# EAGLE board main (EAGLE 7.7.0)
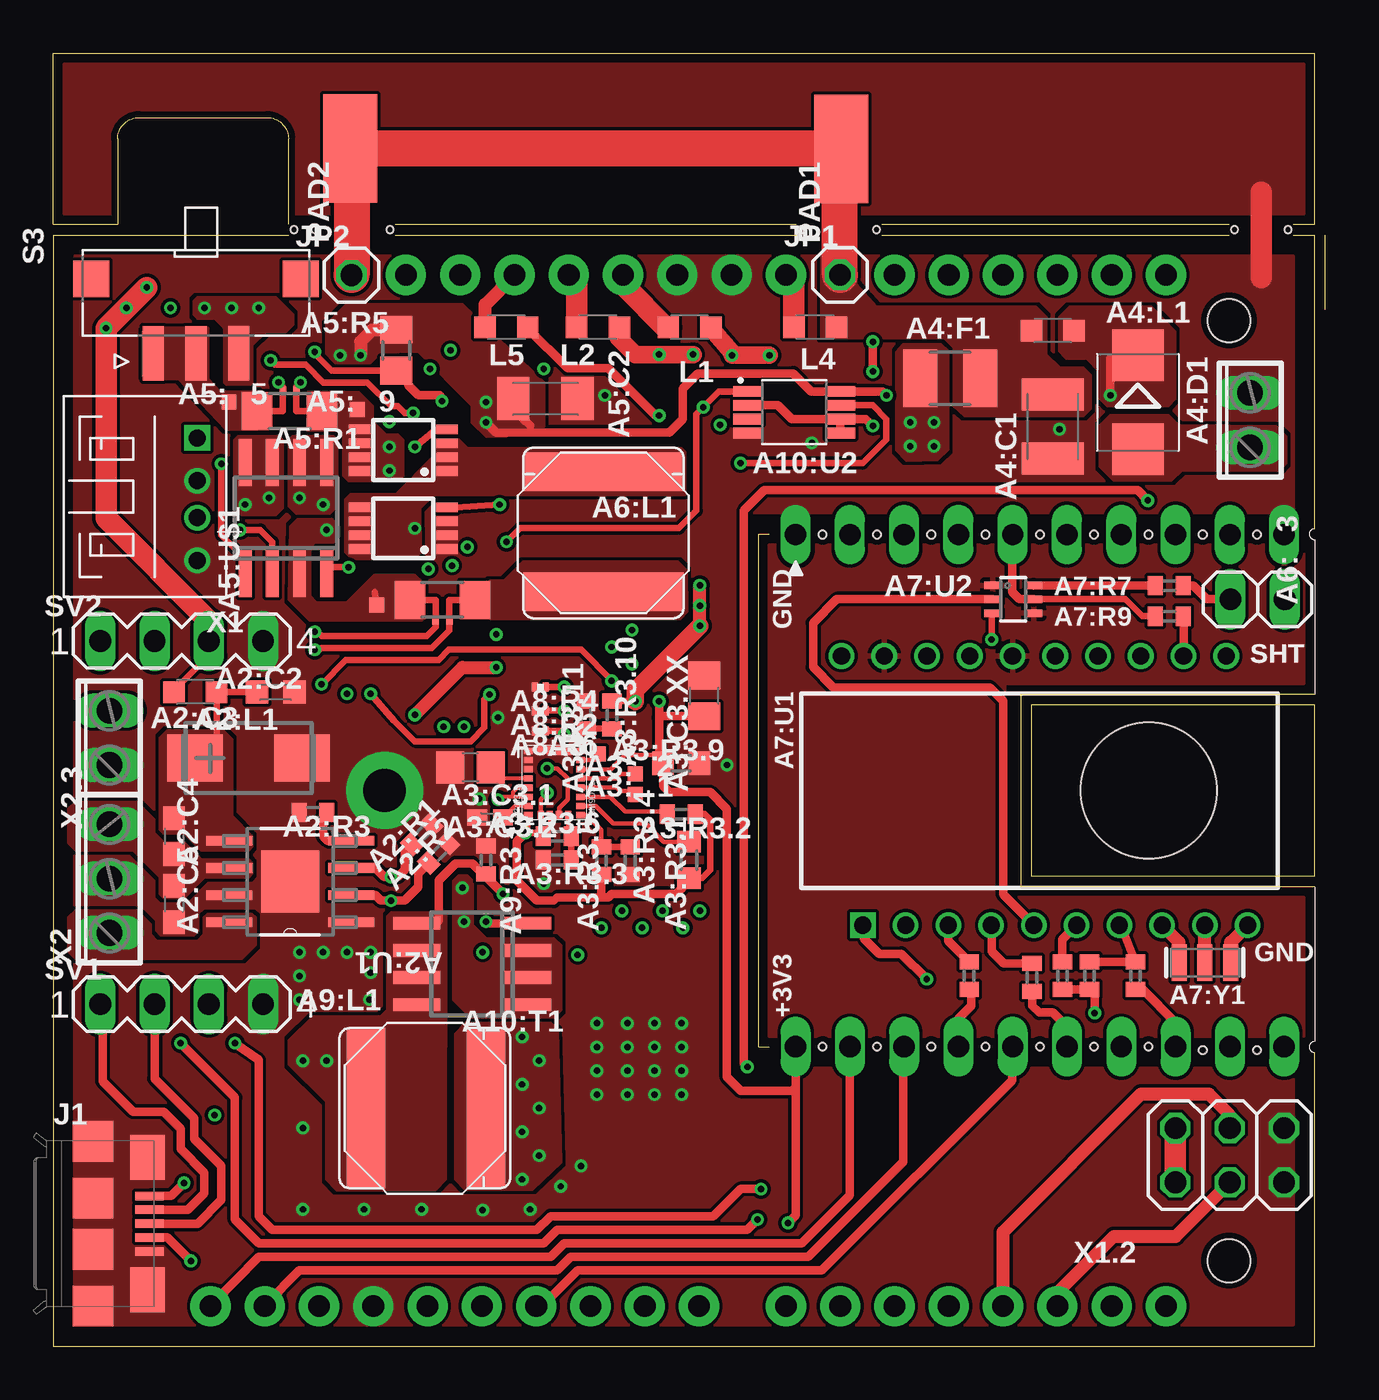
[diagram p13: board, top side]
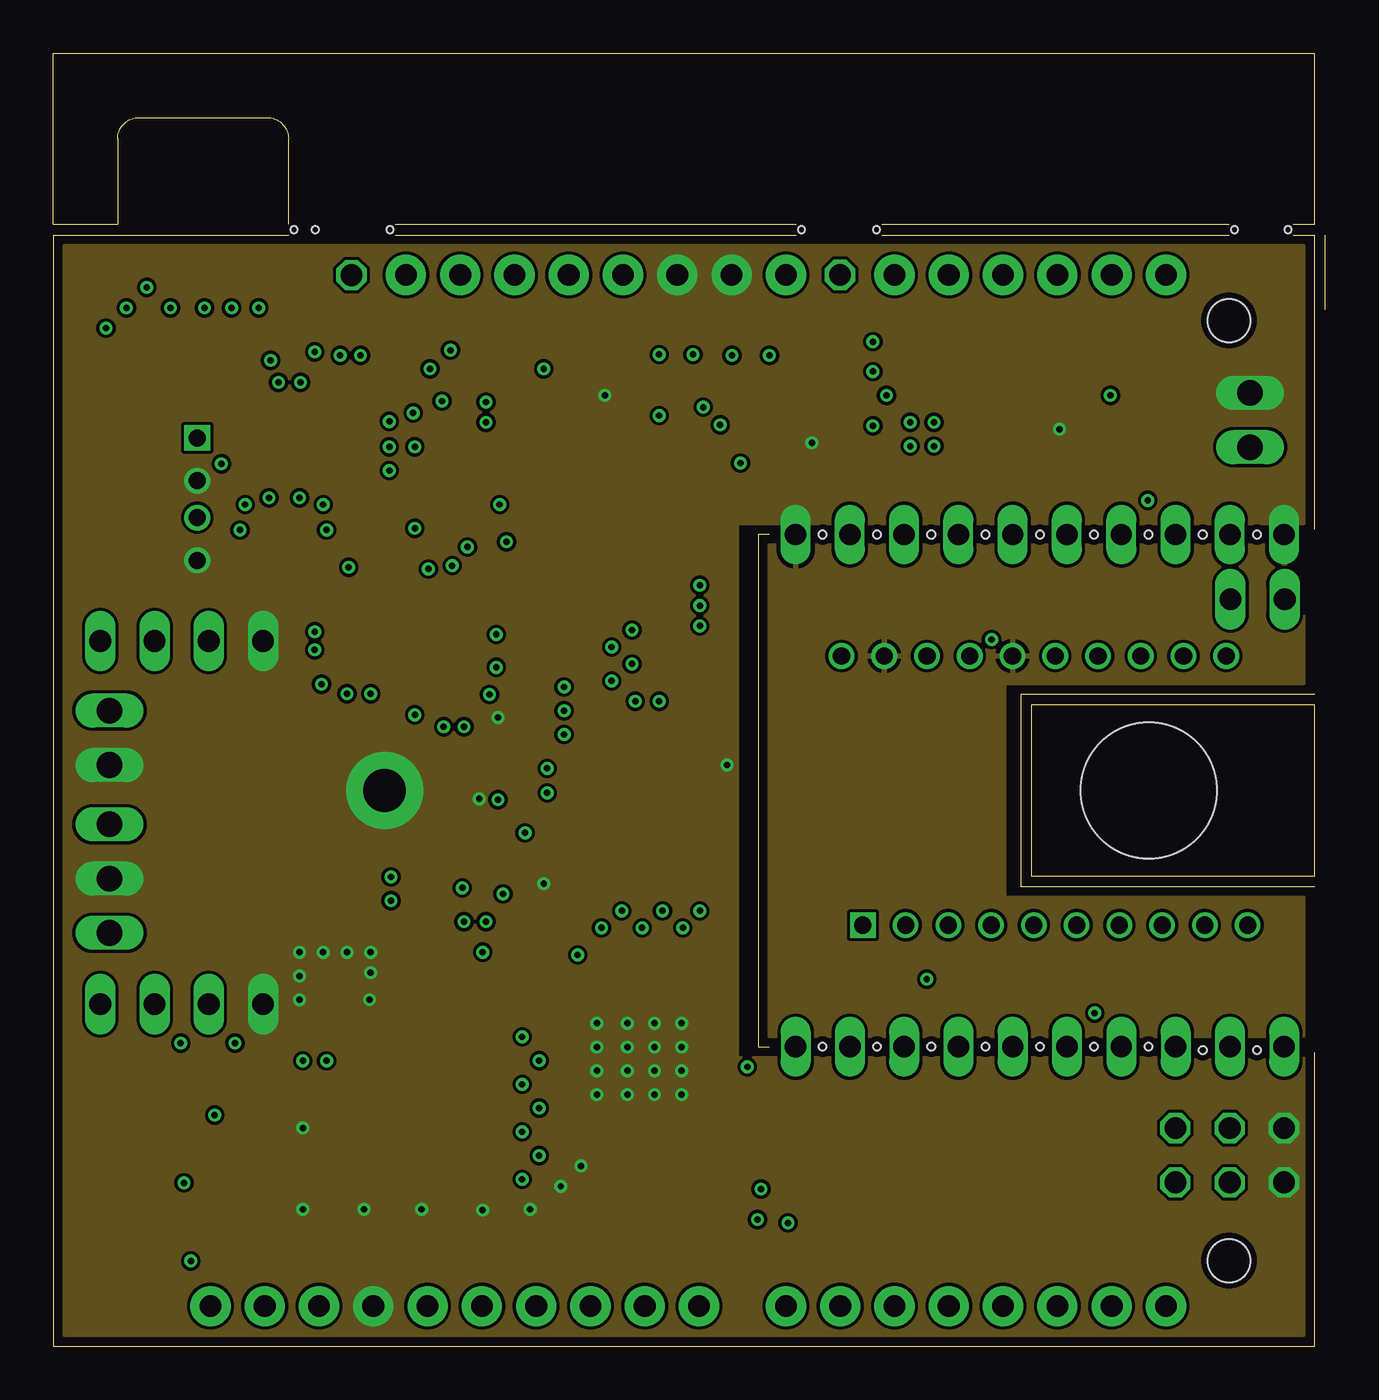
[diagram p14: board, inner layer Route2]
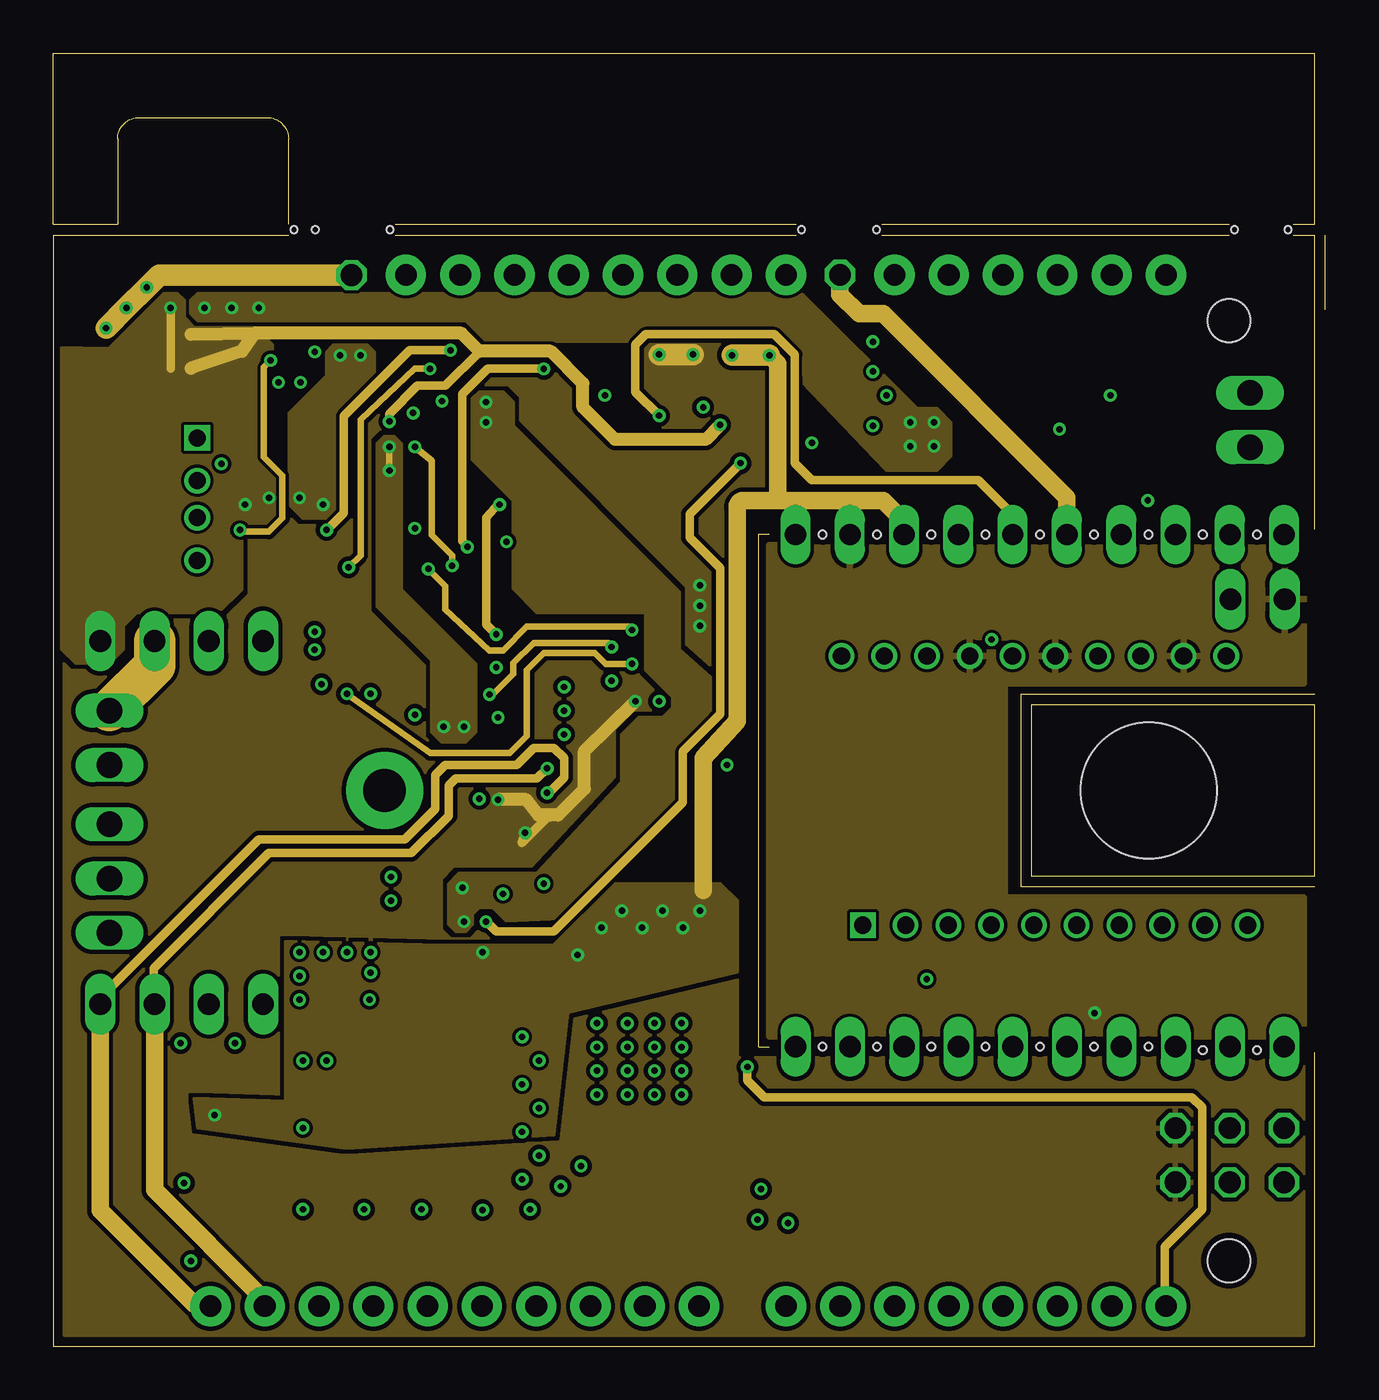
[diagram p15: board, inner layer Route15]
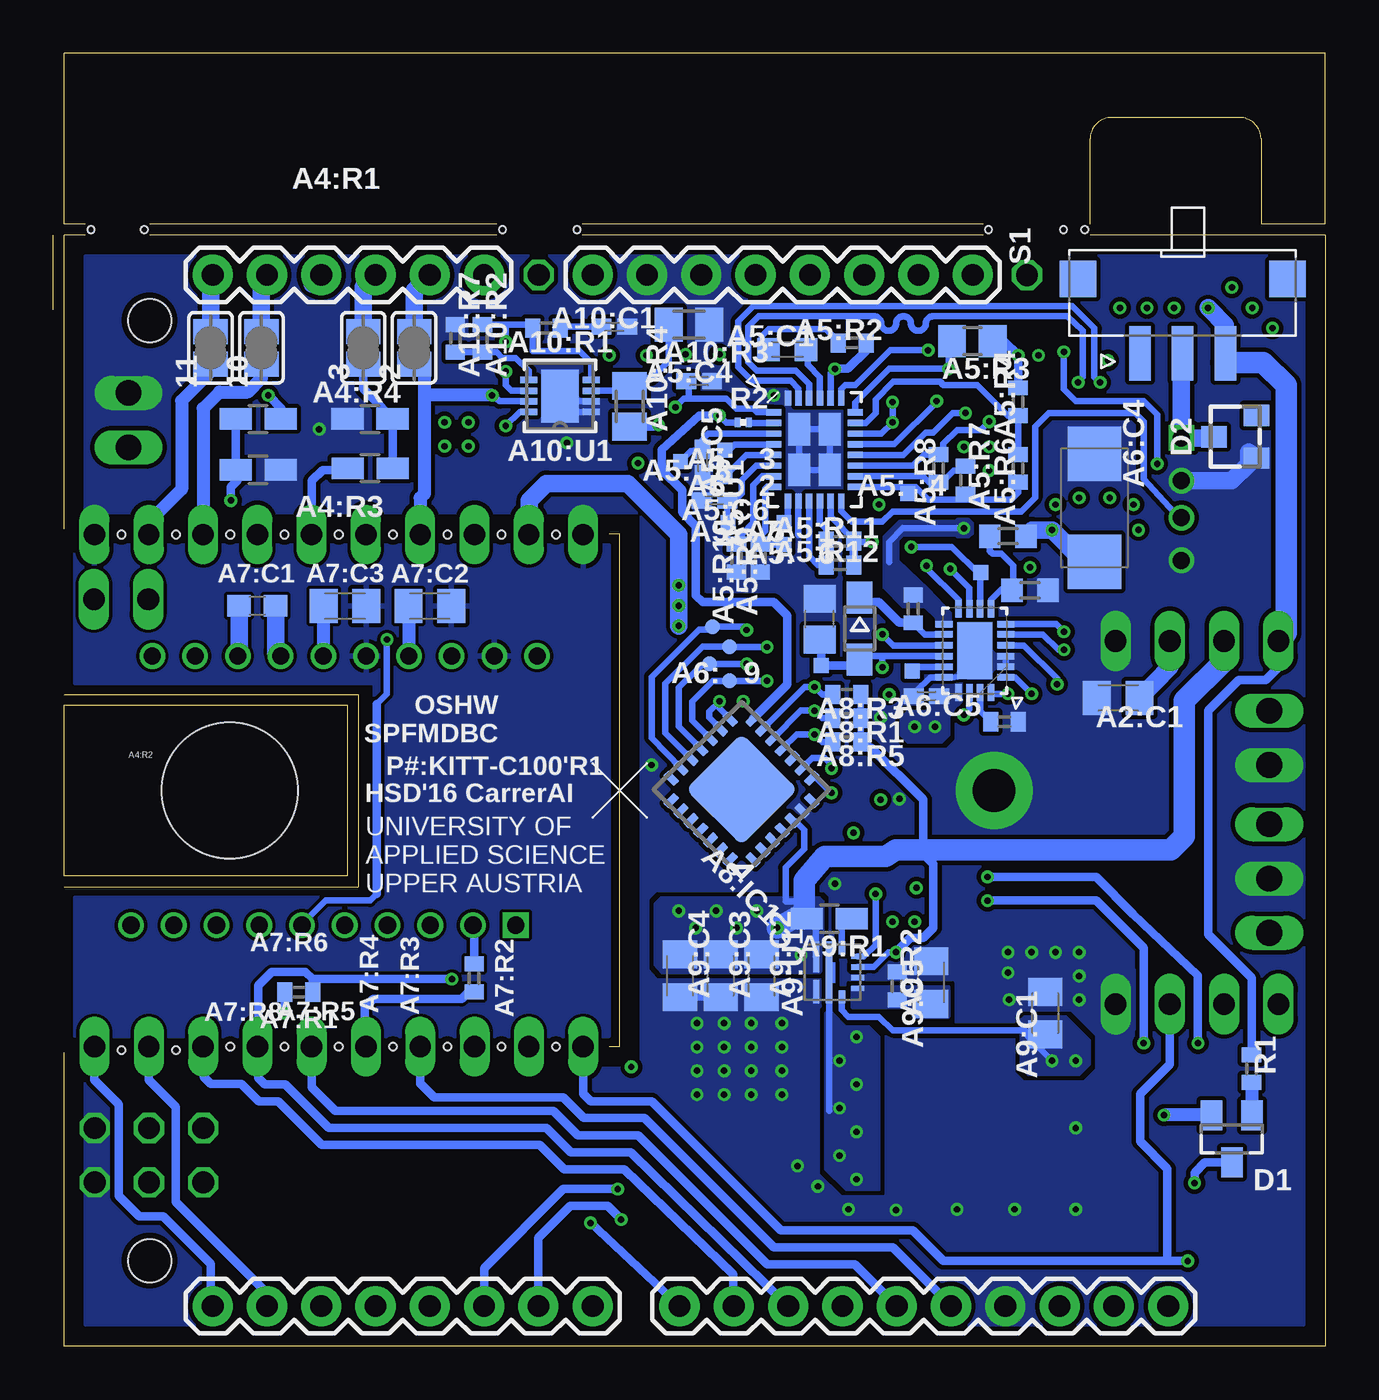
[diagram p16: board, bottom side, seen from below]

Size 59.5 x 60.5 mm. Coordinates in mm from the lower left corner, seen from the top.
Outline: 11,52 0,52 0,0 59,0 59,13.75
Outline: 16,52 34.75,52
Outline: 38.75,52 55,52
Outline: 58,52 59,52 59,38.25
Outline: 59,30.5 45.25,30.5 45.25,21.5 59,21.5
Outline: 33.5,14 33,14 33,38 33.5,38
Outline: 59.5,48.5 59.5,52
Outline: 16,52.5 34.75,52.5
Outline: 38.75,52.5 55,52.5
Outline: 58,52.5 59,52.5 59,60.5 0,60.5 0,52.5 3,52.5 3,56.5 arc-90 4,57.5 10,57.5 arc-90 11,56.5 11,52.5
Outline: 59,30 45.75,30 45.75,22 59,22 59,30
Copper layers (1+2*15+16): Top 0.035mm / dielectric 0.38mm / Route2 0.035mm / dielectric 0.71mm / Route15 0.035mm / dielectric 0.38mm / Bottom 0.035mm
Design rules "PCB-POOL Standard_ML4": minimum track width 0.15mm, minimum drill 0.3mm, track to track 0.15mm, track to pad 0.15mm, pad to pad 0.15mm, via to via 0.15mm, smd to smd 0.15mm, copper to edge 0.3mm, drill to drill 0.2mm, minimum pad ring 0.2mm, minimum via ring 0.15mm, stop-mask expansion 0.075mm, vias tented up to drill 0mil, thermal gap 0.2mm
Holes 0.35 mm at 35.99,37.98 38.53,37.98 41.07,37.98 43.61,37.98 46.15,37.98 48.69,37.98 51.23,37.98 53.77,37.98 56.31,37.98 56.31,13.85 53.77,13.85 51.23,14.01 48.69,14.01 46.15,14.01 43.61,14.01 41.07,14.01 38.53,14.01 35.99,14.01
Holes 2 mm at 55,4 55,48
Holes 0.3 mm at 12.25,52.25 15.75,52.25 35,52.25 38.5,52.25 55.25,52.25 57.75,52.25 11.25,52.25
Milling: area -49,-60 to -41,-58

## Footprints (pad centres in the part's own frame; a part is rotated, then mirrored left to right if it is on the bottom)
C0805K = smd 1.3 x 1.6: 1 -1,0; 2 1,0
C0603K = smd 1.05 x 1.08: 1 -0.875,0; 2 0.875,0
CT6032 = smd 2.6 x 2.2: + -2.5,0; - 2.5,0
C0603 = smd 1.1 x 1: 1 -0.85,0; 2 0.85,0
L2012C = smd 1 x 1: 1 -1,0; 2 1,0
R0402 = smd 0.7 x 0.9: 1 -0.65,0; 2 0.65,0
HSOP8 = smd 2.15 x 0.45: 1 -2.857,1.905; 2 -2.857,0.635; 3 -2.857,-0.635; 4 -2.857,-1.905; 5 2.857,-1.905; 6 2.857,-0.635; 7 2.857,0.635; 8 2.857,1.905 | smd 2.7 x 2.9: THERMAL 0,0
C0805 = smd 1.3 x 1.5: 1 -0.95,0; 2 0.95,0
C0402K = smd 0.925 x 0.74: 1 -0.6,0; 2 0.6,0
R0603 = smd 1 x 1.1: 1 -0.85,0; 2 0.85,0
LGA-24 = smd 0.29 x 0.4: 1 -0.025,2.45; 6 -0.025,0; 7 0.405,0; 8 0.835,0; 9 1.264,0; 10 1.694,0; 11 2.124,0; 12 2.554,0; 13 2.985,0; 18 2.985,2.45; 19 2.554,2.45; 20 2.124,2.45; 21 1.694,2.45; 22 1.264,2.45; 23 0.835,2.45; 24 0.405,2.45 | smd 0.4 x 0.29: 2 -0.025,1.87; 3 -0.025,1.44; 4 -0.025,1.01; 5 -0.025,0.58; 14 2.985,0.58; 15 2.985,1.01; 16 2.985,1.44; 17 2.985,1.87
TP07SQ = smd 0.7 x 0.7: TP 0,0
C1210K = smd 1.5 x 2.9: 1 -1.5,0; 2 1.5,0
SMB = smd 2.4 x 2.4: A 2.2,0; C -2.2,0
R1210 = smd 1.6 x 2.7: 1 -1.4,0; 2 1.4,0
R0805W = smd 1.5 x 1: 1 -1.052,0; 2 1.052,0
C1206K = smd 1.5 x 2: 1 -1.5,0; 2 1.5,0
R1206-KELV = smd 1.422 x 1.778: + -1.524,0; - 1.524,0 | smd 0.305 x 0.406: K+ -0.318,-0.953; K- 0.318,-0.953
R0805 = smd 1.3 x 1.5: 1 -0.95,0; 2 0.95,0
QFN-28_UFD-L = smd 0.703 x 0.3: 1 -1.902,1.75; 2 -1.902,1.25; 3 -1.902,0.75; 4 -1.902,0.25; 5 -1.902,-0.25; 6 -1.902,-0.75; 7 -1.902,-1.25; 8 -1.902,-1.75; 15 1.902,-1.75; 16 1.902,-1.25; 17 1.902,-0.75; 18 1.902,-0.25; 19 1.902,0.25; 20 1.902,0.75; 21 1.902,1.25; 22 1.902,1.75 | smd 0.3 x 0.703: 9 -1.25,-2.402; 10 -0.75,-2.402; 11 -0.25,-2.402; 12 0.25,-2.402; 13 0.75,-2.402; 14 1.25,-2.402; 23 1.25,2.402; 24 0.75,2.402; 25 0.25,2.402; 26 -0.25,2.402; 27 -0.75,2.402; 28 -1.25,2.402 | smd 1.016 x 1.524: EP-NE 0.714,0.953; EP-NW -0.714,0.953; EP-SE 0.714,-0.953; EP-SW -0.714,-0.953
SOIC8 = smd 0.6 x 2.2: 1 -1.905,-2.6; 2 -0.635,-2.6; 3 0.635,-2.6; 4 1.905,-2.6; 5 1.905,2.6; 6 0.635,2.6; 7 -0.635,2.6; 8 -1.905,2.6
C0402 = smd 0.7 x 0.9: 1 -0.65,0; 2 0.65,0
C/6032-28R = smd 2.55 x 2.5: + 2.525,0; - -2.525,0
SOD323-W = smd 1.5 x 1.2: A 1.45,0; C -1.45,0
TAIYO-YUDEN.NRS8030T4R7MJGJ = smd 1.8 x 7.5: 1 -2.54,0; 2 3.06,0
MSOP8 = smd 0.45 x 1: 1 -0.975,-2.05; 2 -0.325,-2.05; 3 0.325,-2.05; 4 0.975,-2.05; 5 0.975,2.05; 6 0.325,2.05; 7 -0.325,2.05; 8 -0.975,2.05
QFN50P = smd 0.813 x 0.305: 1 -1.448,1.245; 2 -1.448,0.762; 3 -1.448,0.254; 4 -1.448,-0.254; 5 -1.448,-0.762; 6 -1.448,-1.245; 11 1.448,-1.245; 12 1.448,-0.762; 13 1.448,-0.254; 14 1.448,0.254; 15 1.448,0.762; 16 1.448,1.245 | smd 0.305 x 0.813: 7 -0.762,-1.956; 8 -0.254,-1.956; 9 0.254,-1.956; 10 0.762,-1.956; 17 0.762,1.956; 18 0.254,1.956; 19 -0.254,1.956; 20 -0.762,1.956 | smd 1.651 x 2.642: 21 0,0
TP07R = smd 0.7 x 0.7: TP 0,0
C1608 = smd 1.1 x 1: 1 -0.85,0; 2 0.85,0
1X02 = drill 1.016 long: 1 -1.27,0; 2 1.27,0
ADNS-3080 = drill 0.8 square: 1 -8.126,-6.3 | drill 0.8: 2 -6.126,-6.3; 3 -4.126,-6.3; 4 -2.126,-6.3; 5 -0.126,-6.3; 6 1.874,-6.3; 7 3.874,-6.3; 8 5.874,-6.3; 9 7.874,-6.3; 10 9.874,-6.3; 11 8.874,6.3; 12 6.874,6.3; 13 4.874,6.3; 14 2.874,6.3; 15 0.874,6.3; 16 -1.126,6.3; 17 -3.126,6.3; 18 -5.126,6.3; 19 -7.126,6.3; 20 -9.126,6.3 | hole 6.35: 5.254,0
SC70-6 = smd 0.35 x 0.8: 1 -0.65,-0.95; 2 0,-0.95; 3 0.65,-0.95; 4 0.65,0.95; 5 0,0.95; 6 -0.65,0.95
RESON-SMD = smd 0.7 x 1.7: 1 -1.2,0; 2 0,0; 3 1.2,0
PAD40MIL.BREAK_PILOT = drill 1 pad 1.016 long: P$1 0,0
PAD40MIL.BREAK = drill 1 pad 1.016 long: P$1 0,0
QFN28-ML_6X6MM = smd 0.7 x 0.35: 1 -2.7,1.95; 2 -2.7,1.3; 3 -2.7,0.65; 4 -2.7,0; 5 -2.7,-0.65; 6 -2.7,-1.3; 7 -2.7,-1.95; 15 2.7,-1.95; 16 2.7,-1.3; 17 2.7,-0.65; 18 2.7,0; 19 2.7,0.65; 20 2.7,1.3; 21 2.7,1.95 | smd 0.35 x 0.7: 8 -1.95,-2.7; 9 -1.3,-2.7; 10 -0.65,-2.7; 11 0,-2.7; 12 0.65,-2.7; 13 1.3,-2.7; 14 1.95,-2.7; 22 1.95,2.7; 23 1.3,2.7; 24 0.65,2.7; 25 0,2.7; 26 -0.65,2.7; 27 -1.3,2.7; 28 -1.95,2.7 | smd 3.7 x 3.7: EXP 0,0
R0201 = smd 0.28 x 0.43: 1 -0.255,0; 2 0.255,0
9-VQFN-HR = smd 1.1 x 0.3: 1 -0.895,0.77 | smd 2.9 x 0.3: 2 0,0.17 | smd 0.6 x 0.3: 3 -1.15,-0.425; 8 1.15,-0.425 | smd 0.25 x 0.6: 4 -0.75,-1.175; 5 -0.25,-1.175; 6 0.25,-1.175; 7 0.75,-1.175 | smd 1.45 x 0.3: 9 0.72,0.77
M0805 = smd 1.3 x 1.6: 1 -0.95,0; 2 0.95,0
DFN-8_DD = smd 0.787 x 0.305: 1 -1.46,0.75; 2 -1.46,0.25; 3 -1.46,-0.25; 4 -1.46,-0.75; 5 1.46,-0.75; 6 1.46,-0.25; 7 1.46,0.25; 8 1.46,0.75 | smd 1.753 x 2.489: EP 0,0
SOP65P490X110-8N = smd 1.38 x 0.5: 1 -2.165,0.975; 2 -2.165,0.325; 3 -2.165,-0.325; 4 -2.165,-0.975; 5 2.165,-0.975; 6 2.165,-0.325; 7 2.165,0.325; 8 2.165,0.975
SOT23 = smd 1 x 1.4: 1 -0.95,-1.1; 2 0.95,-1.1; 3 0,1.1
TO236 = smd 1 x 1.2: 1 -1,-1; 2 0,1; 3 1,-1
10118192-0001LF = smd 0.4 x 1.35: 1 -1.3,4.1; 2 -0.65,4.1; 3 0,4.1; 4 0.65,4.1; 5 1.3,4.1 | smd 1.9 x 1.9: M1 -1.2,1.45; M2 1.2,1.45; S1 -3.85,1.45; S2 3.85,1.45 | smd 2.1 x 1.6: S3 -3.1,4; S4 3.1,4
1X01 = drill 1.016 octagon: 1 0,0
SMD2,54-5,08 = smd 2.54 x 5.08: 1 0,0
SW_SS312SAH4-R = smd 2.55 x 1: 1 1.525,-2; 2 1.525,0; 3 1.525,2 | smd 1.7 x 1.7: P$1 -1.95,-4.9; P$2 -1.95,4.9
MA04-1 = drill 1.016 long: 1 -3.81,0; 2 -1.27,0; 3 1.27,0; 4 3.81,0
JST-PHR-4 = drill 0.8 square: 1 0,0 | drill 0.8: 2 -2,0; 3 -3.73,0; 4 -5.73,0
2X03 = drill 1.016 octagon: 1 -2.54,-1.27; 2 -2.54,1.27; 3 0,-1.27; 4 0,1.27; 5 2.54,-1.27; 6 2.54,1.27
3POL254 = drill 1.2 long: 1 -2.54,0; 2 0,0; 3 2.54,0
2POL254 = drill 1.2 long: 1 -1.27,0; 2 1.27,0
AU_PINS = drill 1.016 pad 1.88: 3.3V -8.89,-24.13; 5V -6.35,-24.13; ADC.0 6.35,-24.13; ADC.1 8.89,-24.13; ADC.2 11.43,-24.13; ADC.3 13.97,-24.13; ADC.4 16.51,-24.13; ADC.5 19.05,-24.13; AREF -20.574,24.13; GND2 -1.27,-24.13; GND3 -3.81,-24.13; GND.1 -18.034,24.13; I/OREF -13.97,-24.13; IO.0 19.05,24.13; IO.1 16.51,24.13; IO.2 13.97,24.13; IO.3 11.43,24.13; IO.4 8.89,24.13; IO.5 6.35,24.13; IO.6 3.81,24.13; IO.7 1.27,24.13; IO.8 -2.794,24.13; IO.9 -5.334,24.13; IO.10 -7.874,24.13; IO.11 -10.414,24.13; IO.12 -12.954,24.13; IO.13 -15.494,24.13; N/C -16.51,-24.13; RESET -11.43,-24.13; SCL -25.654,24.13; SDA -23.114,24.13; VIN 1.27,-24.13
SJ = smd 1.168 x 1.6: 1 -0.762,0; 2 0.762,0

## Placement (x,y rotation side)
A2:C1  4.7uF/25V  [C0805K]  9.68,30.34 180 bottom
A2:C2  100nF/25V⇤  [C0603K]  10.4,30.61 0 top
A2:C3  47uF/25V⇤  [CT6032]  9.13,27.51 0 top
A2:C4  220nF/25V⇤  [C0603]  5.64,23.86 270 top
A2:C5  220nF/25V⇤  [C0603]  5.64,20.69 270 top
A2:L1  BEAD  [L2012C]  6.63,30.61 180 top
A2:R1  10kR/⎑  [R0402]  17.23,23.94 45 top
A2:R2  10kR/⎑  [R0402]  18.02,23.07 45 top
A2:R3  2k2R  [R0402]  12.14,24.97 180 top
A2:U1  DRV8871  [HSOP8]  11.08,21.74 180 top
A3:C3.1  10nF/⇤  [C0805]  19.52,27.09 180 top
A3:C3.2  100nF/⇤  [C0402K]  20.43,24.74 180 top
A3:C3.XX  10nF/⇤  [C0805]  30.45,30.43 90 top
A3:R3.1  10kR/⎒  [R0603]  29.73,22.75 90 top
A3:R3.2  10kR/⎒  [R0402]  29.37,24.89 180 top
A3:R3.3  10kR/⎑  [R0402]  23.57,22.75 180 top
A3:R3.4  10kR/⎑  [R0402]  26.99,22.72 270 top
A3:R3.5  10kR/⎒  [R0402]  25.64,22.72 90 top
A3:R3.6  10kR/⎒  [R0402]  23.57,23.86 0 top
A3:R3.9  60R/⇤  [R0603]  29.37,27.28 0 top
A3:R3.10  10k/⎒  [R0402]  26.13,29.53 270 top
A3:R3.11  10kR/⎑  [R0402]  24.92,29.54 90 top
A3:U3.1  LSM9DS1  [LGA-24]  24.66,24.87 90 top
A3:☇1  PTR1TP07SQ  [TP07SQ]  27.23,25.81 0 top
A3:☇2  PTR1TP07SQ  [TP07SQ]  27.23,26.77 0 top
A3:☇3  PTR1TP07SQ  [TP07SQ]  25.48,27.72 0 top
A4:C1  10uF  [C1210K]  46.75,43.04 270 top
A4:D1  [SMB]  50.74,44.17 270 top
A4:F1  1.5A->750mA  [R1210]  41.96,45.29 180 top
A4:L1  BEAD  [L2012C]  46.75,47.52 180 top
A4:R1  10kR  [R0805W]  49.93,43.39 0 bottom
A4:R2  2.2kR  [R0805W]  49.93,41.01 180 bottom
A4:R3  10kR  [R0805W]  44.68,41.09 180 bottom
A4:R4  2.2kR  [R0805W]  44.69,43.39 0 bottom
A5:C1  47nF/⇤  [C0603K]  25.16,46.64 0 bottom
A5:C2  100uF/~5V  [C1206K]  23.02,44.34 0 top
A5:C4  1uF/⇤  [C0402K]  29.29,45.17 0 bottom
A5:C5  10nF/⇤  [C0402K]  29.13,41.37 270 bottom
A5:C6  10nF/⇤  [C0402K]  28.58,39.58 180 bottom
A5:R1  8.2mR/⚻  [R1206-KELV]  11.05,43.76 180 top
A5:R2  16kR/⇤  [R0402]  22.13,46.94 0 bottom
A5:R3  1MR  [R0805]  16.51,47.04 180 bottom
A5:R4  270kR  [R0402]  14.37,44.2 90 bottom
A5:R5  5mR  [R0805]  16.03,46.61 90 top
A5:R6  100kR  [R0402]  14.37,41.08 90 bottom
A5:R7  27kR/1%  [R0402]  16.83,40.53 270 bottom
A5:R8  68kR/1%  [R0402]  18.1,41.08 90 bottom
A5:R9  1kR/⇤  [R0402]  26.43,36.88 90 bottom
A5:R10  1kR/⇤  [R0402]  27.54,36.88 90 bottom
A5:R11  10kR/⎒  [R0402]  22.7,37.67 0 bottom
A5:R12  10kR/⎒  [R0402]  22.7,36.56 0 bottom
A5:U1  LTC4000LTC4000EUFD#XXX  [QFN-28_UFD-L]  23.89,41.96 0 bottom
A5:U$1  IRF7328  [SOIC8]  10.88,38.75 0 top
A5:☇1  PTR1TP07SQ  [TP07SQ]  25.32,38.54 180 bottom
A5:☇2  PTR1TP07SQ  [TP07SQ]  28.1,40.69 180 bottom
A5:☇3  PTR1TP07SQ  [TP07SQ]  28.1,41.94 180 bottom
A5:☇4  PTR1TP07SQ  [TP07SQ]  19.53,39.89 0 bottom
A5:☇5  PTR1TP07SQ  [TP07SQ]  8.21,44.18 0 top
A5:☇6  PTR1TP07SQ  [TP07SQ]  25.32,37.52 180 bottom
A5:☇7  PTR1TP07SQ  [TP07SQ]  27.94,38.54 180 bottom
A5:☇8  PTR1TP07SQ  [TP07SQ]  30.16,41.4 180 bottom
A5:☇9  PTR1TP07SQ  [TP07SQ]  14.21,43.83 0 top
A6:C1  1nF/⇤  [C0402]  15,29.23 0 bottom
A6:C2  4.7uF/⇤  [C0805]  23.66,34.02 90 bottom
A6:C3  100nF/⇤  [C0402]  19.27,34.5 90 bottom
A6:C4  100uF  [C/6032-28R]  10.8,39.23 270 bottom
A6:C5  1uF/⇤  [C0402K]  18.65,30.42 180 bottom
A6:D1  30VBD,0.2A  [SOD323-W]  21.78,33.58 270 bottom
A6:L1  10uH  [TAIYO-YUDEN.NRS8030T4R7MJGJ]  25.73,37.85 90 top
A6:R1  15mR/25mW⚻  [R1206-KELV]  18.2,34.92 0 top
A6:R2  51kR/1%  [R0603]  14.84,37.91 180 bottom
A6:R3  12kR/1%  [R0603]  13.81,35.37 0 bottom
A6:T1  XX  [MSOP8]  16.37,41.93 90 top
A6:T2  XX  [MSOP8]  16.37,38.28 90 top
A6:U1  LTC3891QFN50P  [QFN50P]  16.39,32.55 180 bottom
A6:☇1  PTR1TP07SQ  [TP07SQ]  19.33,31.6 270 bottom
A6:☇2  PTR1TP07SQ  [TP07SQ]  16.11,36.21 0 bottom
A6:☇3  PTR1TP07SQ  [TP07SQ]  15.12,34.69 0 top
A6:☇5  PTR1TP07SQ  [TP07SQ]  23.57,31.85 180 bottom
A6:☇6  PTR1TP07R  [TP07R]  27.86,32.72 180 bottom
A6:☇7  PTR1TP07R  [TP07R]  28.66,33.67 0 bottom
A6:☇8  PTR1TP07R  [TP07R]  27.86,31.13 0 bottom
A6:☇9  PTR1TP07R  [TP07R]  28.81,31.92 180 bottom
A7:C1  2.2uF/⇤  [C1608]  49.96,34.65 0 bottom
A7:C2  100nF/⇤  [C0805K]  41.89,34.64 0 bottom
A7:C3  100nF/⇤  [C0805K]  45.86,34.64 0 bottom
A7:DCL2  DCL.OSH'3MM-SLK'  [DCL.LOGO-OSH.3MM]  35.38,29.08 0 bottom
A7:J1  [1X02]  56.34,34.95 180 top
A7:R1  10kR/⎒  [R0402]  48.02,16.56 0 bottom
A7:R2  100R/⇤  [R0402]  39.82,17.23 90 bottom
A7:R3  100R/⇤  [R0402]  42.84,17.33 90 top
A7:R4  100R/⇤  [R0402]  45.78,17.25 90 top
A7:R5  10kR/⎒  [R0402]  47.21,17.33 90 top
A7:R6  10kR/⎒  [R0402]  48.48,17.33 90 top
A7:R7  200R  [R0402]  52.21,35.59 0 top
A7:R8  0R  [R0402]  50.62,17.33 270 top
A7:R9  10kR/⎒  [R0402]  52.21,34.16 180 top
A7:U1  ADNS-3080  [ADNS-3080]  46,26 0 top
A7:U2  SI1922EDH  [SC70-6]  44.91,34.95 270 top
A7:Y1  24MHz  [RESON-SMD]  53.87,17.95 180 top
A7:⌁1  SINGLEPAD40MIL-BREAK.PILOT  [PAD40MIL.BREAK_PILOT]  34.72,37.98 0 top
A7:⌁2  SINGLEPAD40MIL-BREAK  [PAD40MIL.BREAK]  47.42,37.98 0 top
A7:⌁3  SINGLEPAD40MIL-BREAK  [PAD40MIL.BREAK]  42.34,37.98 0 top
A7:⌁4  SINGLEPAD40MIL-BREAK  [PAD40MIL.BREAK]  37.26,37.98 0 top
A7:⌁5  SINGLEPAD40MIL-BREAK  [PAD40MIL.BREAK]  39.8,37.98 0 top
A7:⌁6  SINGLEPAD40MIL-BREAK  [PAD40MIL.BREAK]  44.88,37.98 0 top
A7:⌁7  SINGLEPAD40MIL-BREAK  [PAD40MIL.BREAK]  49.96,37.98 0 top
A7:⌁8  SINGLEPAD40MIL-BREAK  [PAD40MIL.BREAK]  52.5,37.98 0 top
A7:⌁9  SINGLEPAD40MIL-BREAK  [PAD40MIL.BREAK]  55.04,37.98 0 top
A7:⌁10  SINGLEPAD40MIL-BREAK  [PAD40MIL.BREAK]  57.58,37.98 0 top
A7:⌁11  SINGLEPAD40MIL-BREAK  [PAD40MIL.BREAK]  57.58,14.01 180 top
A7:⌁12  SINGLEPAD40MIL-BREAK  [PAD40MIL.BREAK]  55.04,14.01 180 top
A7:⌁13  SINGLEPAD40MIL-BREAK  [PAD40MIL.BREAK]  52.5,14.01 180 top
A7:⌁14  SINGLEPAD40MIL-BREAK  [PAD40MIL.BREAK]  49.96,14.01 180 top
A7:⌁15  SINGLEPAD40MIL-BREAK  [PAD40MIL.BREAK]  47.42,14.01 180 top
A7:⌁16  SINGLEPAD40MIL-BREAK  [PAD40MIL.BREAK]  44.88,14.01 180 top
A7:⌁17  SINGLEPAD40MIL-BREAK  [PAD40MIL.BREAK]  42.34,14.01 180 top
A7:⌁18  SINGLEPAD40MIL-BREAK  [PAD40MIL.BREAK]  39.8,14.01 180 top
A7:⌁19  SINGLEPAD40MIL-BREAK  [PAD40MIL.BREAK]  37.26,14.01 180 top
A7:⌁20  SINGLEPAD40MIL-BREAK  [PAD40MIL.BREAK]  34.72,14.01 180 top
A8:IC1  MCP23017ML  [QFN28-ML_6X6MM]  27.31,26.05 135 bottom
A8:R1  10kR/⎒  [R0402]  22.38,29.38 180 bottom
A8:R2  10kR/⎑  [R0201]  22.78,29.74 180 top
A8:R3  10kR/⎒  [R0402]  22.38,30.5 180 bottom
A8:R4  10kR/⎒  [R0201]  22.78,30.85 180 top
A8:R5  10kR/⎒  [R0402]  22.38,28.27 180 bottom
A8:R6  10kR/⎒  [R0201]  22.78,28.78 180 top
A9:C1  10uF/⇤  [C0805K]  13.1,15.58 90 bottom
A9:C2  22uF/⇤  [C0805K]  26.37,17.33 270 bottom
A9:C3  22uF/⇤  [C0805K]  28.28,17.33 270 bottom
A9:C4  22uF/⇤  [C0805K]  30.18,17.33 270 bottom
A9:C5  100nF  [C0805K]  18.44,17.01 90 bottom
A9:L1  1uH  [TAIYO-YUDEN.NRS8030T4R7MJGJ]  17.17,11.14 0 top
A9:R1  10kR/⎒  [R0805W]  23.2,20 180 bottom
A9:R2  0R/⎵  [R0402]  20.02,16.85 270 bottom
A9:R3  100kR/⎵  [R0402]  20.24,22.75 270 top
A9:U1  TPS6123X5V  [9-VQFN-HR]  23.04,17.49 90 bottom
A10:C1  1uF/⇤  [C0402K]  33.26,47.71 0 bottom
A10:R1  430R  [R0402]  36.43,47.64 180 bottom
A10:R2  25kR  [R0402]  39.43,47.17 270 bottom
A10:R3  XXMR  [M0805]  29.77,47.8 180 bottom
A10:R4  XXMR  [M0805]  32.54,43.99 270 bottom
A10:R7  2.32MR  [R0402]  40.7,47.17 270 bottom
A10:T1  SI4427BDY  [SOIC8]  19.59,17.89 90 top
A10:U1  LTC1540CDD  [DFN-8_DD]  35.8,44.47 180 bottom
A10:U2  2NANDSOP8  [SOP65P490X110-8N]  34.65,43.71 0 top
D1  BAS40-05  [SOT23]  4.37,9.7 180 bottom
D2  MMBZXAL  [TO236]  4.21,42.56 90 bottom
GUIDE1  BREAK.GUIDE40MIL-BREAK  [PAD40MIL.HOLEGUIDE]  -9.18,7.59 90 top  (outside the outline)
J1  MICROUSB-FEM  [10118192-0001LF]  0.4,5.73 270 top
JP1  [1X01]  36.8,50.14 0 top
JP2  [1X01]  13.95,50.13 0 top
L1  BEAD/0R/⎵  [L2012C]  29.77,47.67 180 top
L2  BEAD/0R/⎵  [L2012C]  25.48,47.67 180 top
L4  BEAD/0R/⎵  [L2012C]  35.64,47.67 180 top
L5  BEAD/0R/⎵  [L2012C]  21.19,47.67 180 top
PAD1  WIREPADSMD2,54-5,08  [SMD2,54-5,08]  36.86,56.03 0 top
PAD2  WIREPADSMD2,54-5,08  [SMD2,54-5,08]  13.89,56.06 0 top
R1  100R  [R0402]  3.45,12.99 270 bottom
R2  [R0201]  27.23,43.23 0 bottom
REF1  EAGLE EDU LIMIT  [REF_EAGLE.EDULIMIT]  -5.06,-18.92 0 top  (outside the outline)
S1  SS312SAH4-R  [SW_SS312SAH4-R]  6.67,47.99 270 bottom
S3  SS312SAH4-R  [SW_SS312SAH4-R]  6.67,47.99 270 top
SV1  [MA04-1]  6,16 0 top
SV2  [MA04-1]  6,33 0 top
U$1  [A4L-LOC]  -56.25,-67.25 0 top  (outside the outline)
X1  JST-4POS-2X4POS  [JST-PHR-4]  6.73,42.5 90 top
X1.2  TACH/LAP  [2X03]  55.03,8.93 180 top
X2  [3POL254]  2.62,21.88 90 top
X2.2  VRAILS+  [2POL254]  55.99,43.34 90 top
X2.3  5V+SoC  [2POL254]  2.62,28.47 90 top
XA1  ARDUINO_UNO  [AU_PINS]  33,26 180 bottom
☈2  [SJ]  42.62,46.72 90 bottom
☈3  [SJ]  45.01,46.72 90 bottom
☈10  [SJ]  49.77,46.72 90 bottom
☈11  [SJ]  52.15,46.72 90 bottom

## Tracks (layer width: path | path; a pad name or v marks a point on that pad's centre or on a via)
!CS0  (via drill 0.3)
  Top 0.406: A7:U1.1 37.92,19.65 37.92,19.08 38.64,18.37 39.67,18.37 v40.86,17.17
  Bottom 0.406: XA1.IO.10 32.48,9.07 35.29,9.07 36.43,10.21 46.63,10.21 48.66,12.24 49.61,12.24 49.93,12.56 49.93,13.98 A7:⌁14.P$1 49.93,14.01 49.93,16.88 49.29,17.51 47.71,17.51 47.37,17.17 | v40.86,17.17 47.37,17.17 | 47.37,17.17 A7:R1.2
!CS1
  Top 0.406: A7:R8.2 50.95,16.68 52.53,15.11 52.53,14.04 A7:⌁13.P$1
  Bottom 0.406: XA1.IO.9 27.7,1.91 27.7,3.35 32.78,8.27 35.61,8.27 36.75,9.42 46.95,9.42 48.98,11.45 49.89,11.45 50.72,12.27 52.15,12.27 52.47,12.59 52.47,13.98 A7:⌁13.P$1
!RST
  Bottom 0.305: R2.2 26.95,43.21 A5:U1.2
+3V3  (via drill 0.3)
  Top 0.178: A3:U3.1.23 21.51,25.71 | 21.51,25.71 20.93,25.71 v20.8,25.58 | A3:U3.1.3 23.22,24.38 23.14,24.3 23.14,24.08 A3:R3.6.1 | 21.51,25.71 21.51,25.93 21.72,26.14 A3:U3.1.22
  Top 0.203: A3:U3.1.1 22.21,24.01
  Top 0.305: A3:R3.10.1 26.91,30.18 v27.23,30.18 | v22.07,24.02 22.21,24.01 22.62,24.01 A3:R3.6.1 | A3:R3.2.1 30.48,24.89 30.72,24.66 30.72,22.27 30.34,21.9 A3:R3.1.1 29.73,21.77
  Top 0.406: A7:R5.1 A7:R6.1 48.72,16.45 v48.72,15.59 | A7:R9.1 52.87,34.15 A7:U1.12 | 29.73,21.77 29.13,21.16 26.11,21.16 25.96,21.01 25.64,21.01 | 25.64,21.01 23.57,21.01 23.42,20.85 22.62,20.85 21.67,21.8 21.67,23.62 v22.07,24.02 | A3:R3.5.1 25.64,21.01
  Top 0.61: v30.24,33.7 v30.24,35.61
  Top 0.813: L2.1 26.43,47.59 26.43,47.2 27.23,46.41 v28.34,46.41 v29.92,46.41 | v27.23,30.18 27.23,30.69 v30.24,33.7
  Top 1.016: X1.2.6 X1.2.5
  Route15 0.406: v22.07,24.02 21.92,23.55 A3:U3.1.3
  Route15 0.61: v27.22,30.18 v27.23,30.18 24.84,27.83 24.84,26.09 23.61,24.85 A3:U3.1.3 22.69,24.85 22.12,25.58 v20.8,25.58
  Route15 1.016: v29.92,46.41 v28.34,46.41
  Bottom 0.406: v48.72,15.59 48.66,16.24 A7:R1.1
  Bottom 0.61: A7:C3.1 46.87,34.63 A7:U1.15 | A7:C2.1 42.87,34.64 A7:U1.17
  Bottom 0.813: A7:⌁4.P$1 37.23,38.01 37.23,39.58 36.43,40.37 32.62,40.37 30.24,37.99 v30.24,35.61 v30.24,34.66 v30.24,33.7
  pour Route15: 33.5,37.5 33.5,14.5 58.5,14.5 58.5,21 44.5,21 44.5,31 58.5,31 58.5,37.5
  pour Route15 (isolate 0.203, rank 5): 34.22,51.5 34.22,42.72 35,42 37.5,39.5 37.5,38.5 32,38.5 32,13.5 58.5,13.5 58.5,0.5 0.5,0.5 0.5,51.5
+4.1V  (via drill 0.3)
  Route15 0.305: v15.72,43.28 15.72,43.43
  Route15 0.406: 5.48,45.74 v5.48,48.59 | v15.72,43.28 15.72,43.63 17.03,44.94 18.34,44.94 19.92,46.53 19.92,46.56
  Route15 0.61: 9.41,47.4 19.09,47.4 19.92,46.56 23.26,46.56 24.77,45.06 24.77,43.94 26.27,42.44 30.51,42.44 v31.2,43.12 | 6.43,47.36 9.41,47.4 | 9.41,47.4 8.81,46.56 6.43,45.77
  Bottom 0.305: A5:U1.17 19.29,41.21 18.77,41.73 A5:R8.2 | 18.5,41.73 A5:R8.2 | 18.21,41.89 A5:R8.2 | 32.47,43.04 A10:R4.2 | 18.34,41.73 A5:R8.2 | v15.72,43.28 16.11,42.88 17.23,42.88 17.86,42.24 17.86,41.97 A5:R8.2 | 18.02,41.81 A5:R8.2
  Bottom 0.406: 32.47,43.04 31.43,43.04 v31.2,43.12 | R1.1 3.45,17.23 5.48,19.26 5.48,29.74 4.05,31.16 2.78,31.16 2.14,31.8 2.14,32.95 SV2.1
  Bottom 0.813: 4.67,46.04 S1.3 4.67,47.78 v5.48,48.59
  Bottom 1.016: 4.67,46.04 2.89,46.04 1.83,44.98 1.83,33.36 SV2.1
  other vias: 8.97,39.39 10.08,39.7
  pour Top (isolate 0.152, no thermals): 10.72,42.4 10.56,42.56 8.65,42.56 8.49,42.4 8.49,39.23 8.81,38.91 10.4,38.91 10.72,39.23
  pour Route15 (isolate 0.152, no thermals): 0.4,46.72 0.4,32.59 1.03,31.96 2.62,31.96 3.26,32.59 3.26,33.7 3.89,34.34 7.7,34.34 8.81,35.42 8.81,38.27 10.4,38.27 10.24,46.88 9.45,47.67 6.59,47.67 6.11,48.15 6.11,48.94 5.79,49.26 5.16,49.26 2.59,46.69 2.38,46.69
+5V  (via drill 0.3)
  Top 0.813: 31.86,46.37 v33.5,46.37 | L1.1 30.8,47.64 30.8,47.6 31.86,46.37 | 31.86,46.37 v31.75,46.37
  Route15 0.813: v33.5,46.37 33.89,45.97 33.89,39.58 | 39.8,38.59 38.81,39.58 33.89,39.58 | 33.89,39.58 32.31,39.58 arc90 31.99,39.26 31.99,29.26 30.4,27.51 30.4,21.32
  Route15 1.016: v31.75,46.37 v33.5,46.37 | 39.8,38.59 A7:⌁5.P$1
  Route15 1.93: X2.3.2 4.73,31.85 SV2.2
  Bottom 0.305: A9:U1.9 23.83,18.23 23.83,19.93 A9:R1.2 24.25,20.81 25.24,20.81 25.24,22.4 24.37,23.27 24.37,24.15 24.78,24.56 A8:IC1.5 | A8:R3.1 A8:R1.1 A8:R5.1 | A9:U1.6 21.13,17.74 20.43,18.43 v20.08,18.43
  Bottom 0.406: A8:R5.1 21.26,28.02 18.81,25.58 18.81,23.03 18.34,22.56 18.34,19.58 18.81,19.1 19.41,19.1 v20.08,18.43
  Bottom 0.61: D1.2 v7.54,10.81
  Bottom 1.016: v25.64,19.58 24.53,20.21 24.37,20.37 24.37,21.8 23.42,22.91 20.56,22.91 20.08,23.23 7.22,23.23 6.59,23.86 6.59,30.21 4.73,32.07 SV2.2
  other vias: 24.53,18.31 26.59,20.37 29.45,19.58 28.5,20.37 27.54,19.58 30.24,20.37
  pour Bottom (isolate 0.152, no thermals): 23.65,17.48 23.54,17.64 23.52,20.82 23.68,20.98 29.77,20.97 31.04,21.01 31.35,20.69 31.35,17.83 31.04,17.48
  pour Route15 (isolate 0.152, rank 2, no thermals): 24.05,15.61 23.42,9.89 13.73,9.26 6.75,10.21 6.59,11.61 10.88,11.45 10.88,18.94 18.18,18.75 23.38,18.75 26.27,21.64 31.2,21.64 31.99,20.85 31.99,17.51
+18V  (via drill 0.3)
  Top 0.305: A2:L1.2 5.63,30.69 7.27,32.32 SV2.3
  Top 0.813: 43.07,44.62 A4:F1.1
  Top 1.016: SV2.3 7.27,33.94 2.46,38.75 v2.46,47.64 v4.37,49.55
  Top 1.676: PAD2.1 arc-90 13.95,56 | 13.95,56 JP2.1 | 13.95,56 arc-90 14,56.06 36.84,56.06 PAD1.1 36.8,55.97 JP1.1
  Route15 0.813: JP1.1 36.8,49.2 37.69,48.31 38.81,48.31 47.42,39.7 A7:⌁2.P$1
  Route15 1.016: JP2.1 4.95,50.13 v4.37,49.55 v3.41,48.59 v2.46,47.64
  Bottom 0.406: 46.28,41.18 A4:R3.2 45.81,41.01 46.91,41.01 47.42,40.5 A7:⌁2.P$1
  Bottom 0.813: A2:C1.1 7.27,31.78 SV2.3
  pour Top (isolate 0.152, no thermals): 45.96,48.63 38.5,48.63 37.55,49.7 37.55,50.97 35.96,50.97 35.96,47.2 41.67,47.2 42.15,46.72 42.15,43.99 42.62,43.55 48.18,43.55 48.5,43.87 48.5,45.45 48.18,45.77 47.07,45.77 46.44,46.41 46.44,48.15
A2:ILIM
  Top 0.406: A2:U1.4 12.84,23.65 12.62,23.86 12.62,24.8 A2:R3.1
A2:VM
  Top 0.305: A2:C2.1 A2:L1.1 7.63,28.2 A2:C3.+
  pour Top (no thermals): 5,24.18 5.16,24.02 6.11,24.02 6.91,23.23 9.13,23.23 9.29,23.39 9.29,23.86 8.34,24.81 8.34,28.39 7.94,28.78 5.32,28.78 5,28.47
A3:CS_AG
  Top 0.203: A3:R3.1.2 28.56,23.6 27.7,24.46 26.19,24.46 25.38,25.28 A3:U3.1.7
A3:CS_M
  Top 0.203: 28.56,25.02 26.75,25.02 26.06,25.71 A3:U3.1.8
  Top 0.305: 28.56,25.02 A3:R3.2.2
A3:DEN_AG
  Top 0.203: A3:U3.1.13 24.66,28.63
  Top 0.305: 26.22,28.91 A3:R3.10.2 | A3:R3.10.2 26.36,28.91 | 24.66,29.05 A3:R3.11.1 | A3:R3.10.2 26.12,28.89 A3:R3.11.1 | 24.66,28.63 A3:R3.11.1
A3:DRDY_M
  Top 0.203: A3:☇1.TP 27.07,25.97 26.51,25.97 26.35,26.14 A3:U3.1.9
A3:INT2_AG
  Top 0.203: A3:☇3.TP 25.24,27.43 A3:U3.1.12
A3:INT_M
  Top 0.203: A3:☇2.TP 26.51,26.77 26.31,26.57 A3:U3.1.10
A3:SDO_AG
  Top 0.203: A3:U3.1.5 24.08,23.84
  Top 0.305: 24.08,23.84 A3:R3.6.2 A3:R3.3.1
A3:SDO_M
  Top 0.203: A3:R3.5.2 25.64,24.15 24.94,24.85 A3:U3.1.6
  Top 0.305: A3:R3.4.1 A3:R3.5.2
A3:↔C1
  Top 0.178: A3:U3.1.24 21.57,25.28 A3:C3.2.1
A3:↔CAP
  Top 0.178: A3:U3.1.21 21,26.57
  Top 0.305: 21,26.57 A3:C3.1.1
A4:N$1  (via drill 0.3)
  Top 0.305: 50.05,46.42 A4:D1.C
  Top 0.406: 50.24,46.51 A4:D1.C | v49.45,44.5 49.45,46.25
  Bottom 0.406: v49.45,44.5 48.81,43.86 A4:R1.2
  pour Top (isolate 0.152, no thermals): 47.07,46.56 47.39,46.25 48.34,46.25 48.98,45.58 48.98,44.34 49.29,44.02 52.15,44.02 52.47,44.34 52.47,47.48 51.36,48.63 47.55,48.63 47.07,48.15
A5:BGATE  (via drill 0.3)
  Top 0.305: v16.83,43.67 16.43,43.67 16.11,43.99 15.8,43.99 14.68,45.1 12.62,45.1 11.79,45.93 10.37,45.93 v10.16,46.13 | v8.73,38.2 9.68,38.2 10.24,37.64 A5:U$1.2
  Route15 0.305: v10.16,46.13 9.84,45.82 9.84,41.61 10.72,40.74 10.72,38.75 10.08,38.12 8.65,38.12 v8.73,38.2
  Bottom 0.305: A5:U1.18 19.75,41.71 18.7,42.75 18.34,42.75 17.42,43.67 v16.83,43.67
A5:CC
  Bottom 0.305: A5:C1.2 24.21,46.64 24.21,45.93 23.64,45.36 A5:U1.25
A5:CL
  Bottom 0.305: A5:U1.8 26.12,40.21 26.19,40.13 26.19,38.15 26.43,37.91 A5:R9.2 26.42,37.52 A5:☇6.TP
A5:CSN  (via drill 0.3)
  Top 0.305: A5:U$1.1 8.97,36.85 7.86,37.96 v7.86,41.29 | 15.71,45.5 A5:R5.1 13.02,45.66 12.3,46.37 v12.22,46.53
  Top 0.406: A5:R5.1 16.59,45.1 16.59,44.98 17.07,44.5 18.06,44.5 v18.18,44.23
  Bottom 0.305: v7.86,41.29 7.86,43.59 8.49,44.23 11.67,44.23 12.22,44.78 v12.22,46.53 | A5:U1.19 20.15,42.21 18.18,44.18 v18.18,44.23
A5:CX
  Bottom 0.305: A5:U1.7 26.33,40.71 26.75,40.29 26.75,38.55 27.31,37.99 27.31,37.77 arc90 A5:R10.2
A5:IBMON
  Bottom 0.305: A5:U1.6 26.63,41.21 27.3,40.53 27.3,39.89 27.7,39.5 | A5:C6.1 27.98,38.58 arc-90 A5:☇7.TP
  Bottom 0.406: A5:C6.1 27.9,39.5 27.7,39.5
A5:IGATE  (via drill 0.3)
  Top 0.305: 12.78,35.97 A5:U$1.4 12.78,36.45 v13.81,36.45
  Route15 0.305: v13.81,36.45 14.37,37.01 14.37,43.35 16.91,45.74 v17.62,45.74
  Bottom 0.305: 17.62,46.61 v17.62,45.74 20.4,45.74 21.99,44.15 A5:U1.22
  Bottom 0.406: 17.62,46.72 A5:R3.2 17.62,46.61
A5:IIMON
  Bottom 0.305: A5:U1.3 28.86,42.71 29.13,42.44 A5:C5.1 29.67,41.89 A5:☇8.TP
A5:IL
  Bottom 0.305: A5:U1.4 25.8,42.2 27.62,42.2 27.8,42.02 A5:☇3.TP
A5:N$4
  Bottom 0.305: 26.31,46.85 A5:C1.1 26.35,46.64 26.35,47.28 26.04,47.59 23.37,47.59 23.13,47.36 A5:R2.1
A5:N$8
  Bottom 0.305: A5:U1.16 18.83,40.71 18.56,40.43 A5:R8.1 18.19,40.58 17.78,40.58 17.38,40.97 16.95,40.97 A5:R7.1
A5:OFB
  Bottom 0.305: A5:R6.2 A5:R4.1 14.84,43.55 16.27,44.98 17.86,44.98 18.02,45.14 20.21,45.14 21.04,44.31 21.04,43.67 21.5,43.21 A5:U1.21
A5:TMR
  Bottom 0.305: A5:U1.9 25.14,38.88 A5:☇1.TP
A5:↔CLN  (via drill 0.3)
  Top 0.305: A5:R1.K+ 11.36,44.91 v11.56,45.1
  Bottom 0.305: v11.56,45.1 11.59,45.13 11.56,45.13 11.35,45.34 11.35,47.51 12.07,48.2 18.35,48.2 arc-90 18.69,47.86 arc90 19.03,47.52 19.04,47.52 arc90 19.38,47.86 arc-90 19.72,48.2 19.74,48.2 arc-90 20.08,47.86 arc90 20.42,47.52 20.43,47.52 arc90 20.77,47.86 arc-90 21.11,48.2 26.51,48.2 26.99,47.72 26.99,46.05 26.59,45.66 24.77,45.66 24.14,45.03 A5:U1.26
A5:↔FBG
  Bottom 0.305: 21.67,40.21 A5:U1.15 19.61,40.21 | 16.83,39.62 18.57,39.62 19.16,40.21 19.61,40.21 | 16.83,39.62 16.75,39.88 A5:R7.2 16.67,39.64 16.83,39.62 | 19.61,40.21 A5:☇4.TP | 16.83,39.62 14.68,39.62 14.37,39.94 A5:R6.1 | A5:R6.1
A5:↔IN  (via drill 0.3)
  Top 0.305: A5:R1.K- 10.73,44.9 v10.53,45.1
  Bottom 0.305: v10.53,45.1 10.56,45.1 10.8,45.34 10.8,47.64 11.83,48.67 26.75,48.67 27.46,47.96 27.46,45.82 26.83,45.18 25,45.18 24.64,44.82 A5:U1.27
A6:BG  (via drill 0.3)
  Top 0.305: A6:T2.4 18.44,39.23 v20.88,39.39
  Route15 0.406: v20.88,39.39 20.84,39.42 20.24,38.78 20.24,33.78 v20.72,33.31
  Bottom 0.305: A6:U1.13 20.22,32.8 20.72,33.3 v20.72,33.31
A6:DDC.EXTVCC
  Bottom 0.305: A6:U1.15 18.98,31.78 19.37,31.4 19.29,31.4 A6:☇1.TP
A6:SW✳  (via drill 0.3)
  Bottom 0.305: v16.91,38.27 19.77,38.27 20.4,37.64 20.4,36.69
  pour Top (isolate 0.152, no thermals): 13.67,39.63 13.67,37.16 13.99,36.85 16.84,36.85 17.16,37.16 17.15,39.23 17.78,39.86 29.53,39.86 29.53,41.85 29.37,42.01 19.37,42.01 18.97,42.4 17.78,42.4 17.78,41.61 16.03,39.86 14.53,39.86 13.91,39.86
  pour Bottom (isolate 0.152, no thermals): 18.18,34.07 18.18,33.83 17.54,33.75 17.54,34.31 18.57,35.42 20,36.77 20,37.72 19.77,37.96 17.3,37.96 17.23,37.88 16.67,37.88 16.51,38.04 16.51,38.51 16.67,38.67 17.23,38.67 17.3,38.59 19.92,38.59 20.64,37.88 20.64,35.5 19.77,34.62 18.73,34.62
A6:TG  (via drill 0.3)
  Top 0.305: 18.1,42.91 18.09,42.91 A6:T1.4 18.39,42.88 17.86,42.88 v16.91,42.09
  Route15 0.305: v18.65,36.53 18.65,37.01 17.7,37.96 17.7,41.45 v16.91,42.09
  Bottom 0.305: A6:U1.10 17.16,34.91 18.65,36.4 v18.65,36.53
A6:TRACK/SS
  Bottom 0.305: A6:U1.19 16.14,29.73 15.95,29.54 A6:C1.1
A6:~SENSE+
  Top 0.305: A6:L1.1 26.18,35.75
  pour Top (isolate 0.152, no thermals): 20.43,35.8 21.1,35.8 21.99,36.69 29.21,36.69 29.61,36.29 29.63,34.37 29.32,34.05 20.43,34.05
A6:↔BOOST
  Bottom 0.305: A6:U1.12 18.73,33.31 A6:C3.1 19.29,33.86
  Bottom 0.406: 19.29,33.86 19.92,33.86 20.88,34.82 21.72,34.82 A6:D1.C
A6:↔ILIM  (via drill 0.3)
  Top 0.61: v16.91,29.54 19.13,31.77 v20.72,31.77
  Bottom 0.305: A6:U1.18 16.65,29.8 v16.91,29.54 | A6:U1.14 20.72,32.29 | 20.72,32.29 v20.72,31.77 | 20.72,32.29 21.67,32.29 A6:D1.A 21.99,32.24
  Bottom 0.406: 21.99,32.24 22.15,31.85 A6:☇5.TP 23.57,33.07 A6:C2.1
A6:↔SENSE+  (via drill 0.3)
  Top 0.305: v12.22,33.43 12.34,33.43 12.54,33.23 17.46,33.23 17.89,33.65 A6:R1.K+
  Bottom 0.305: v12.22,33.43 12.58,33.79 A6:U1.6
A6:↔SENSE-  (via drill 0.3)
  Top 0.305: v12.22,32.59 12.22,32.56 12.38,32.56 12.54,32.67 17.7,32.67 18.52,33.49 A6:R1.K-
  Bottom 0.305: v12.22,32.59 12.49,32.59 13.21,33.31 A6:U1.5
A6:↔VFB
  Bottom 0.305: A6:U1.7 15.63,34.95 15.16,35.42 15.11,35.37 | 14.66,35.42 A6:R3.1 14.61,35.42 14.61,36.53 15.16,37.08 15.56,37.08 15.69,37.22 A6:R2.2
  Bottom 0.406: A6:R3.1 15.11,35.37
A7:!PD
  Top 0.406: A7:U1.7 arc-90 49.99,19.58 A7:R8.1 A7:R6.2
A7:LEDCTRL
  Top 0.406: A7:U1.5 44.43,21.14 44.43,30.19 43.8,30.83 36.49,30.83 35.54,31.78 35.54,33.84 36.65,34.95 A7:U2.2
A7:N$1
  Top 0.406: A7:U2.6 51.43,35.6 51.57,35.59 A7:R7.1
A7:N$5
  Bottom 0.813: A7:C1.1 50.81,32.36 arc90 A7:U1.13
A7:N$6
  Bottom 0.813: A7:C1.2 49.11,32.54 arc-90 A7:U1.14
A7:N$8
  Top 0.406: A7:R7.2 53.32,35.59 53.95,34.95 A7:J1.2
A7:RST  (via drill 0.3)
  Top 0.305: A7:U2.3 43.9,34.24 v43.9,33.07
  Top 0.406: A7:R5.2 47.21,19.03 A7:U1.6
  Bottom 0.305: v43.9,33.07 43.9,30.53 44.37,30.05 | 44.37,21.16 44.69,20.85 46.75,20.85 47.87,19.73 A7:U1.6
  Bottom 0.406: 44.37,30.05 44.37,21.16
A7:U1.GUARD
  Top 0.61: A7:Y1.2 A7:U1.9
A7:U1.MISO
  Bottom 0.406: A7:R2.2 39.82,19.64 A7:U1.2
A7:U1.MOSI
  Top 0.406: A7:R4.2 44.46,17.9 43.9,18.47 43.9,19.67 A7:U1.4
A7:U1.OSCIN✳
  Top 0.61: A7:Y1.1 55.07,18.9 A7:U1.10
A7:U1.OSCOUT✳
  Top 0.61: A7:Y1.3 52.67,18.9 A7:U1.8
A7:U1.SCLK
  Top 0.406: A7:R3.2 41.87,18.95 A7:U1.3
A8:A0  (via drill 0.3)
  Top 0.152: 23.1,28.78 A8:R6.1
  Top 0.305: v23.89,28.62 23.73,28.78 23.1,28.78
  Bottom 0.305: A8:IC1.11 24.73,28.62 v23.89,28.62 23.54,28.27 A8:R5.2
A8:A1  (via drill 0.3)
  Top 0.152: A8:R2.1 23.1,29.74
  Top 0.305: 23.1,29.74 v23.89,29.74
  Bottom 0.305: A8:IC1.12 24.54,29.74 v23.89,29.74 23.54,29.38 A8:R1.2
A8:A2  (via drill 0.3)
  Top 0.152: 23.1,30.85 A8:R4.1
  Top 0.305: v23.89,30.85 23.1,30.85
  Bottom 0.305: A8:IC1.13 24.35,30.85 v23.89,30.85 23.54,30.5 A8:R3.2
A9:CC
  pour Bottom (isolate 0.152, no thermals): 17.6,16.81 22.13,16.81 22.13,15.86 19.59,15.86 19.27,15.58 19.27,15.42 19.23,15.38 17.64,15.38 17.6,15.42
A9:✳SW  (via drill 0.3)
  Bottom 0.305: A9:U1.2 23.21,11.01
  other vias: 21.93,14.47 22.72,13.36 21.93,12.25 22.72,11.14 21.93,10.03 22.72,8.91 21.93,7.8
  pour Bottom (isolate 0.152, no thermals): 23.2,15.74 22.62,15.1 22.46,14.94 21.35,14.94 20.88,14.46 20.88,7.32 22.41,7.33 23.36,8.28 23.36,15.58
  pour Top (isolate 0.152, no thermals): 19.29,7.32 22.41,7.33 23.73,8.59 23.57,14.78 23.26,15.1 19.29,15.1 18.81,14.62 18.81,7.8
A10.!ACT  (via drill 0.3)
  Top 0.305: A10:U2.7 38.33,44.03 38.97,43.39 38.97,42.44 37.86,41.33 v32.15,41.33
  Top 0.406: v20.24,19.86 20.31,19.79 A10:T1.4
  Route15 0.406: v20.24,19.86 20.27,19.86 20.72,19.42 23.42,19.42 29.45,25.45 29.45,27.83 31.2,29.58 31.2,36.4 29.77,37.83 29.77,38.94 v32.15,41.33
A10:BATOK  (via drill 0.3)
  Top 0.406: v38.34,43.07 38.01,43.38 A10:U2.6 | 32.97,44.02 A10:U2.2 33.89,44.03 34.54,43.38 A10:U2.6 | A10:U2.5 A10:U2.6
  Bottom 0.305: A10:U1.8 37.69,43.72 v38.34,43.07
A10:COMP
  Bottom 0.305: 35.67,47.59 A10:R1.1 35.72,47.71 A10:C1.1
A10:HYST
  Bottom 0.305: 37.5,45.22 A10:U1.5 37.26,45.64 37.86,46.25 38.5,46.25 38.77,46.52 A10:R2.2 A10:R7.2
A10:IN-
  Bottom 0.305: A10:U1.3 33.1,44.72 | 33.1,44.72 32.69,44.72 A10:R4.1 31.95,45.29 31.51,45.29 30.72,46.09 A10:R3.2 | 32.94,44.88 33.1,44.72
A10:REF  (via drill 0.3)
  Top 0.406: v38.34,45.61 v38.34,47.01
  Bottom 0.305: A10:U1.4 34.34,46.02 34.88,46.56 37.08,46.56 A10:R1.2 37.26,47.81 38.34,47.81 | v38.34,47.01 38.34,47.81 | 39.25,47.83 A10:R2.1 38.34,47.81 | A10:U1.6 38.08,44.72 38.34,44.98 v38.34,45.61
  Bottom 0.406: 39.13,47.8 39.25,47.8 A10:R2.1
CORE.ADCX
  Bottom 0.406: 52.5,39.2 52.5,38.75
  Bottom 0.61: A7:⌁8.P$1 52.5,38.75 52.5,43.88 51.73,44.66 50.41,44.66 49.77,45.3 ☈10.1 49.75,45.82
CORE.ADCY
  Bottom 0.406: 55.04,38.56 A7:⌁9.P$1
  Bottom 0.61: 52.25,45.86 ☈11.1 52.15,45.6 53.5,44.25 53.5,40.1 55.04,38.56
DDC.CLN/VIN  (via drill 0.3)
  Route15 0.305: v15.72,40.97 15.72,42.01 15.64,42.09
  other vias: 18.26,28.99 19.21,28.99 15.72,42.09
  pour Top (isolate 0.152, no thermals): 14.92,43.28 15.56,42.64 16.11,42.64 16.35,42.4 16.35,40.74 16.11,40.5 13.81,40.5 13.57,40.74 13.57,42.56 13.26,42.88 11.91,42.88 11.91,44.62 14.29,44.62 14.92,43.99
  pour Bottom (isolate 0.152, no thermals): 16.99,31 17.3,31 17.38,30.97 18.34,30.97 18.5,30.81 18.5,29.86 18.65,29.7 19.53,29.7 19.84,29.39 19.84,28.59 19.53,28.27 17.94,28.27 17.62,28.59 17.62,29.46 17.07,30.13 16.99,30.21
  pour Route15 (isolate 0.152): 15.48,42.56 15.16,42.24 15.16,35.1 16.27,35.1 16.27,42.24 15.95,42.56
  pour Route15 (isolate 0.152): 15.16,36.37 15.16,34.62 17.7,32.08 17.7,28.75 18.18,28.27 19.29,28.27 19.77,28.75 19.77,31.92 16.27,35.42
GND  (via drill 0.3, 2 pad 2.54)
  Top 1.016: 56.5,54 56.5,50
  Bottom 0.279: A6:U1.16 17.45,31.3 17.07,31.37
  Bottom 0.305: A5:U1.10 24.64,37.95 | A6:U1.16 18.48,31.3 19.13,30.66 | A6:U1.2 A6:U1.3 | A9:C4.2 A9:C3.2 | A10:U1.2 35.01,44.22 A10:U1.EP 35.01,43.72 A10:U1.1 | A5:U1.EP-SE A5:U1.EP-NE A5:U1.EP-NW A5:U1.EP-SW A5:U1.EP-SE
  Bottom 0.813: D2.1 3.57,41.83 3.57,41.29 4.36,40.5 X1.2
  other vias: 15.49,26 11.51,16.21 11.51,17.32 11.51,18.43 12.62,18.43 13.73,18.43 14.84,18.43 14.84,17.48 14.79,16.22 25.42,13.99 25.42,12.88 25.42,11.77 28.12,13.99 26.85,13.99 26.85,12.88 28.12,12.88 28.12,11.77 11.67,10.21 24.69,8.43 23.73,7.48 22.3,6.4 20.08,6.37 17.23,6.4 14.53,6.4 11.67,6.4 26.85,11.77 47.07,42.91 25.8,44.5 25.42,15.11 26.85,15.11 28.12,15.11 29.39,11.77 29.39,12.88 29.39,13.99 29.39,15.11 35.48,42.28 31.51,27.2 22.94,21.64 19.92,25.61 20.8,29.42
  pour Route2 (isolate 0.152): 33.5,37.5 33.5,14.5 58.5,14.5 58.5,21 44.5,21 44.5,31 58.5,31 58.5,37.5
  pour Top: 33.5,37.5 33.5,14.5 58.5,14.5 58.5,21 44.5,21 44.5,31 58.5,31 58.5,37.5
  pour Bottom (isolate 0.152): 33.5,37.5 33.5,14.5 58.5,14.5 58.5,21 44.5,21 44.5,31 58.5,31 58.5,37.5
  pour Top (isolate 0.305, rank 4, no thermals): 14.05,47.17 14.05,36.69 30.95,36.69 30.95,47.17
  pour Route2 (rank 4, no thermals): 58.5,51.5 58.5,38.5 32,38.5 32,13.5 58.5,13.5 58.5,0.5 0.5,0.5 0.5,51.5
  pour Bottom (isolate 0.152, no thermals): 17.33,17.17 17.33,18.92 20.66,18.92 20.66,18.12 21.45,17.33 22.09,17.33 22.09,17.17
  pour Bottom (isolate 0.152, no thermals): 16.06,15.74 16.06,18.92 9.55,18.92 9.55,18.21 8.81,17.48 8.81,14.94 9.29,14.46 10.56,14.46 11.83,15.73
  pour Top (isolate 0.152, rank 6, no thermals): 1,51 1,1 58,1 58,13 32,13 32,39 58,39 58,51
  pour Bottom (isolate 0.203, rank 6, no thermals): 1,51 1,1 58,1 58,13 32,13 32,39 58,39 58,51
  pour Top (isolate 0.152): 58.5,60 58.5,53 0.5,53 0.5,60
ITH  (via drill 0.3)
  Route15 0.406: v22.94,45.74 20.32,45.74 19.13,44.55 19.13,37.67 19.29,37.48 v19.37,37.4
  Bottom 0.305: A6:U1.8 16.14,36.08 16.19,36.13 | 16.19,36.13 17.46,37.4 v19.37,37.4 | A6:☇2.TP 16.19,36.13 | A5:U1.24 23.14,45.53 v22.94,45.74
  Bottom 0.406: A5:R2.2 21.48,46.59 22.34,45.74 v22.94,45.74
LAP
  Top 0.61: XA1.IO.2 46.97,2.49 49.61,5.13 52.5,5.13 X1.2.4
MISO
  Top 0.406: A7:⌁16.P$1 44.85,13.98 44.85,12.43 35.96,3.54 24.53,3.54 23.26,2.27 22.99,2.27 XA1.IO.11
  Bottom 0.305: A7:⌁16.P$1 44.91,14.04 44.91,14.79
  Bottom 0.406: XA1.IO.11 22.57,1.87 | 44.91,14.79 44.93,14.81 44.93,15.85 44.53,16.24 40.4,16.24 40.07,16.58 A7:R2.1
MOSI
  Top 0.406: A7:⌁15.P$1 47.45,14.04 47.45,14.95 47.41,14.95 46.75,15.61 46.12,15.61 45.8,15.92 45.8,16.58 A7:R4.1
  Bottom 0.406: XA1.IO.12 22,3.83 26.11,3.83 32.15,9.86 34.97,9.86 36.12,11 46.31,11 47.42,12.11 A7:⌁15.P$1
N$1  (via drill 0.3)
  Top 0.406: v6.11,7.64 5.51,7.03 J1.1
  Bottom 0.406: D1.3 5.62,8.6 6.11,8.11 v6.11,7.64
N$4
  Bottom 0.61: R1.2 3.45,10.83 D1.1
PWR.MOTA  (via drill 0.3)
  Top 0.406: v33.1,7.35 32.15,7.35 30.88,6.08 23.26,6.08 22.62,5.45 10.24,5.45 9.61,6.08 9.61,13.38 v8.49,14.18 | A2:U1.2 15.06,21.11 15.32,20.85 v15.8,20.85 16.43,20.85 17.07,21.48 17.07,22.12 A2:R2.1
  Bottom 0.406: XA1.IO.5 39.35,3.64 35.64,7.35 v33.1,7.35 | v8.49,14.18 8.49,18.62 10.72,20.85 v15.8,20.85
PWR.MOTB  (via drill 0.3)
  Top 0.406: v32.94,5.92 32.47,5.45 23.57,5.45 22.94,4.81 9.61,4.81 8.49,5.92 8.49,11.64 v5.95,14.18 | A2:U1.3 15.06,22.38 15.48,21.96 v15.8,21.96 16.11,21.96 16.43,22.27 16.43,23.15 A2:R1.1
  Bottom 0.406: XA1.IO.6 36.81,5.07 35.32,6.56 33.58,6.56 v32.94,5.92 | v5.95,14.18 5.95,17.35 8.97,20.21 10.72,21.96 v15.8,21.96
SCLK
  Top 0.406: A7:⌁17.P$1 42.34,15.32 42.94,15.92 42.94,16.58 A7:R3.1
  Bottom 0.406: A7:⌁17.P$1 42.34,12.27 42.31,12.27 41.67,11.64 35.64,11.64 34.69,10.69 31.86,10.69 25.8,4.62 20.24,4.62 17.51,1.89 XA1.IO.13
SYSTWI.!INT  (via drill 0.3)
  Top 0.203: A3:U3.1.11 26.07,27 26.75,27.67 28.52,27.67 A3:R3.9.1
  Top 0.406: J1.4 5.33,5.08 v6.43,3.98 | v34.37,5.77 34.72,6.11 34.72,12.11 | 34.72,12.11 A7:⌁20.P$1 | 34.72,12.11 34.56,11.96 32.15,11.96 31.51,12.59 31.51,25.13 30.72,25.93 28.81,25.93 28.52,26.22 A3:R3.9.1 | 28.3,30.14 v28.34,30.18 28.34,29.42 | A3:R3.9.1 28.52,27.7 | 28.34,29.42 28.34,27.46 A3:R3.9.1 | A3:C3.XX.1 28.44,29.48 28.34,29.42
  Bottom 0.305: A8:IC1.16 28.81,29.42 28.81,29.7 v28.34,30.18 28.47,30.05 28.47,29.97 A8:IC1.15
  Bottom 0.406: A7:⌁20.P$1 34.72,11.8 34.37,11.45 31.51,11.45 25.48,5.41 19.29,5.41 17.86,3.98 7.38,3.98 | v6.43,3.98 7.38,3.98 | SV1.3 7.27,13.18 8.65,11.8 8.65,9.57 7.38,8.3 7.38,3.98 | XA1.IO.8 30.24,1.91 v34.37,5.77
SYSTWI.SCL  (via drill 0.3)
  Top 0.203: A3:U3.1.2 22.79,25.59 v23.1,25.89
  Top 0.406: XA1.SCL 9.61,4.18 23.26,4.18 23.89,4.81 35.01,4.81 37.26,7.07 A7:⌁19.P$1 37.23,13.98 | J1.2 6.29,6.38 7.06,7.16 7.06,8.11 5.95,9.22 5.95,10.18 5.16,10.97 3.73,10.97 2.3,12.4 2.3,15.1 2.19,15.21 SV1.1 2.19,15.53
  Route15 0.406: v23.1,25.89 23.17,25.89 23.89,26.62 23.89,27.51 23.42,27.99 22.46,27.99 21.67,27.2 18.34,27.2 17.86,26.72 17.86,25.13 16.43,23.7 9.61,23.7 2.19,16.29 SV1.1
  Route15 0.813: XA1.SCL 7.26,1.95 6.59,1.95 2.19,6.35 SV1.1
  Bottom 0.305: A8:IC1.8 23.78,26.57 v23.1,25.89
SYSTWI.SDA  (via drill 0.3)
  Top 0.203: v23.1,27.04 23.57,27.04 24.05,26.56 24.05,25.58 23.65,25.18 A3:U3.1.4
  Top 0.406: XA1.SDA 9.92,1.95 11.51,3.54 23.57,3.54 24.21,4.18 35.32,4.18 39.77,8.62 39.77,13.51 39.8,13.51 A7:⌁18.P$1 | 4.84,15.89 SV1.2 4.73,12.51 6.59,10.65 6.59,9.7 7.86,8.43 7.86,6.84 6.75,5.73 J1.3
  Route15 0.305: 39.77,13.98 A7:⌁18.P$1
  Route15 0.406: v23.1,27.04 22.62,26.56 18.81,26.56 18.5,26.24 18.5,24.81 16.75,23.07 10.08,23.07 4.68,17.67 4.68,16.05 SV1.2
  Route15 0.813: XA1.SDA 9.89,2.15 4.73,7.31 SV1.2
  Bottom 0.305: v23.1,27.04 23.1,27.2 23.42,27.51 24,27.51 A8:IC1.9
TACH
  Top 0.61: XA1.IO.3 44.43,5.35 50.88,11.8 54.05,11.8 55.01,10.84 55.01,10.22 X1.2.3
TOP.!CHRG
  Bottom 0.305: A5:U1.12 23.64,38.53 23.35,38.24 A5:R11.1
TOP.!FLT
  Bottom 0.305: A5:U1.11 24.14,36.97 23.73,36.56 A5:R12.1
TOP.!RST  (via drill 0.3)
  Top 0.305: A7:U2.5 50.15,34.95 50.94,34.16 A7:R9.2
  Top 0.406: 22.19,47.63 24.05,45.77 25.96,45.77 28.18,43.55 v28.34,43.55 | A7:U2.5 45.19,34.95 44.85,35.29 44.85,37.95 A7:⌁6.P$1
  Top 0.61: L5.1 22.19,47.63
  Route15 0.406: A7:⌁6.P$1 44.88,38.91 43.26,40.53 35.48,40.53 34.69,41.33 34.69,45.14 34.69,45.29 34.69,46.41 33.73,47.36 27.7,47.36 27.23,46.88 27.23,44.66 v28.34,43.55
  Bottom 0.305: R2.1 28.02,43.23 v28.34,43.55
  Bottom 0.406: v28.34,43.55 29.29,43.55 31.04,41.96 31.04,41.01 30.08,40.05 30.08,39.02 29.45,38.39 29.45,35.13 29.13,34.82 25.8,34.82 25.16,34.18 25.16,30.95 A8:IC1.14
TOP.BAT+NTC
  Bottom 0.305: 6.75,38.75 6.83,38.75 8.49,40.58 8.49,43.28 8.89,43.67 12.94,43.67 13.57,43.04 13.57,39.7 14.21,39.07 20.24,39.07 20.72,38.59 22.15,38.59 22.64,39.09 A5:U1.14
  Bottom 0.406: X1.3 6.75,38.75
TOP.BAT/CON
  Bottom 0.813: S1.2 6.73,46.21 X1.1 5.27,42.5 D2.2
TOP.ENC
  Bottom 0.305: A5:U1.5 27.08,41.71 A5:☇2.TP
TOP.FREQ  (via drill 0.3)
  Top 0.305: v14.84,30.53 15.95,29.26 16.91,28.31 19.53,28.31 20.16,28.94 20.16,30.26 v20.4,30.5
  Route15 0.305: v26.11,32.72 26.11,32.75 25.96,32.91 22.46,32.91 21.51,31.96 21.51,31.45 20.56,30.5 v20.4,30.5
  Bottom 0.305: A8:IC1.19 30.88,28.7 30.88,31.01 29.13,32.75 27.9,32.75 A6:☇6.TP v26.11,32.72 | v14.84,30.53 15.57,30.53 A6:U1.20
TOP.INACT
  Bottom 0.305: A9:R1.1 22.62,19.84 A9:U1.8
TOP.MODE  (via drill 0.3)
  Route15 0.305: v27.07,31.92 25.83,31.92 25.32,32.44 22.94,32.44 22.15,31.64 22.15,28.55 21.35,27.75 17.62,27.75 v13.73,30.53
  Bottom 0.305: 14.93,31.29 A6:U1.1 | A8:IC1.18 30.24,28.99 30.24,30.81 29.32,31.74 arc45 28.87,31.92 A6:☇9.TP v27.07,31.92 | 14.98,31.3 A6:U1.1 | A6:U1.1 14.5,31.3 v13.73,30.53
TOP.MOT-
  pour Top (no thermals): 1.03,20.37 0.71,20.05 0.71,18.47 1.03,18.15 8.81,18.15 9.45,18.78 9.45,20.05 9.29,20.21 7.22,20.21 7.06,20.05 7.06,19.26 6.75,18.94 4.84,18.94 4.53,19.26 4.53,19.73 3.89,20.37
TOP.MTXS
  Bottom 0.406: A7:⌁12.P$1 55.04,12.46 53.78,11.2 53.78,6.76 49.51,2.49 XA1.IO.1
TOP.MVPRW
  Bottom 0.406: A4:R3.1 A4:R4.2 44.27,44.08 45.01,44.82 ☈3.1
TOP.OS1IS2  (via drill 0.3)
  Top 0.305: A6:☇3.TP 15.04,35.3
  Route15 0.406: v12.78,38.2 13.57,38.99 13.57,43.51 16.67,46.61 v18.57,46.61
  Bottom 0.305: v18.57,46.61 20.35,46.61 21.99,44.98 22.46,44.98 22.64,44.8 A5:U1.23
  Bottom 0.813: A6:C4.+ 11.29,36.7 v12.78,38.2 13.71,38.2 A6:R2.1
  pour Top (isolate 0.152, no thermals): 17.23,33.99 11.99,33.99 11.03,34.94 11.11,38.35 11.43,38.67 13.02,38.67 13.34,38.35 13.34,37.88 13.1,37.64 12.22,37.64 11.99,37.4 11.99,35.1 12.3,34.78 13.73,34.78 15,36.05 16.91,36.05 17.22,35.77
TOP.PGOOD  (via drill 0.3)
  Route15 0.305: v17.54,36.37 18.34,35.58 18.34,34.47 20.4,32.56 21.04,32.56 22.15,33.67 26.91,33.67 v27.07,33.51
  Bottom 0.305: A6:U1.9 16.65,35.48 v17.54,36.37 | A8:IC1.20 31.51,28.47 31.51,31.32 29.29,33.55 28.78,33.55 A6:☇7.TP 27.23,33.67 v27.07,33.51
TOP.PWRON  (via drill 0.3)
  Top 0.305: v21.19,37.64 21.83,38.27 29.26,38.27 30.08,39.1 30.08,43.63 v30.4,43.94 31.14,44.68 A10:U2.1
  Bottom 0.305: A5:U1.13 23.14,38.83 21.95,37.64 v21.19,37.64 21.23,37.67 | A5:U1.1 26.59,43.71 26.75,43.87 27.54,43.87 28.02,44.34 29.77,44.34 | A5:C4.1 30.08,45.13 29.92,45.13 29.77,44.98 29.77,44.34 | 29.77,44.34 30,44.34 v30.4,43.94
  Bottom 0.406: A5:R12.2 A5:R11.2 22.02,37.64 21.95,37.64
TOP.RRX  (via drill 0.3)
  Top 0.406: v51.2,39.58 50.72,40.05 33.26,40.05 32.31,39.1 32.31,13.23 v32.47,13.07
  Route15 0.406: v32.47,13.07 32.47,12.43 33.26,11.64 53.26,11.64 53.74,11.16 53.74,6.4 51.99,4.65 51.99,1.93 XA1.IO.0
  Bottom 0.406: A4:R2.2 A4:R1.1 | 50.88,40.95 A4:R2.2 | 51.2,40.86 A4:R2.2 | v51.2,39.58 51.2,40.21 50.88,40.53 50.88,41.11 A4:R2.2 | A7:⌁11.P$1 57.58,12.46 56.44,11.32 56.44,7.04 55.48,6.08 54.37,6.08 52.15,3.86 52.15,1.97 XA1.IO.0
TOP.RUN  (via drill 0.3)
  Top 0.305: v26.11,31.13 26.15,31.13 24.69,32.59 18.5,32.59 18.02,32.12 13.69,32.12 v12.54,30.97
  Bottom 0.305: A6:U1.4 14.1,32.8 12.54,31.24 v12.54,30.97 | A8:IC1.17 29.61,29.27 29.61,30.18 28.66,31.13 A6:☇8.TP v26.11,31.13
TOP.VSYS/GUARD  (via drill 0.3)
  Top 0.305: 18.02,19.89 17.25,19.89 A10:T1.5
  Top 0.406: v21.04,21.16 20.24,21.96 A9:R3.2 20.1,22.1 19.61,22.59 18.81,22.59 18.02,21.8 18.02,19.89
  Bottom 0.305: A9:U1.3 22.62,15.73 22.3,15.41 20.88,15.41 20.24,14.78 14.05,14.78 13.89,14.46 v12.78,13.35 | A9:U1.7 21.58,18.24 21.04,18.78 v21.04,21.16
  other vias: 11.67,13.35
  pour Top (isolate 0.152, no thermals): 18.2,20.27 15.8,20.27 15.64,20.1 15.64,15.73 15.32,15.41 12.14,15.41 11.03,14.3 11.03,13.19 12.78,11.45 12.78,7.8 13.26,7.32 17.86,7.32 18.34,7.8 18.36,20.11
  pour Bottom (isolate 0.152, no thermals): 12.14,15.41 11.03,14.3 11.03,13.19 11.51,12.72 13.89,12.72 14.21,13.03 14.21,15.26 14.05,15.41
UNO.3V3
  Top 1.016: 24.05,50.07 XA1.3.3V 24.11,50.24 24.48,49.82 L2.2
UNO.5V
  Top 1.016: L1.2 28.66,47.67 26.75,49.58 XA1.5V
UNO.ADC1
  Bottom 0.813: ☈2.2 42.62,49.39 XA1.ADC.1
UNO.ADC2
  Bottom 0.813: ☈3.2 45.01,49.55 XA1.ADC.2
UNO.ADC3
  Bottom 0.813: 47.39,49.71 XA1.ADC.3
UNO.ADC4
  Bottom 0.813: ☈10.2 49.77,49.87 XA1.ADC.4
UNO.ADC5
  Bottom 0.813: ☈11.2 52.15,50.03 XA1.ADC.5
UNO.RESET
  Top 0.61: L5.2 20.19,48.75 XA1.RESET
UNO.VIN
  Top 1.016: XA1.VIN 34.64,49.76 L4.2
VCC/2
  pour Top (isolate 0.152, no thermals): 57.19,43.04 57.66,42.56 57.66,41.33 57.34,41.01 52.78,41.01 52.31,40.53 49.61,40.53 48.98,41.17 48.98,43.07 49.45,43.55 52.15,43.55 52.63,43.07
VDD  (via drill 0.3)
  Top 0.305: 22.07,43.93 A5:C2.1 21.99,43.87
  Top 0.406: 22.3,43.07 21.99,43.39 21.99,44.01 A5:C2.1 | v20.24,43.23 20.72,42.75 28.81,42.75 29.45,43.39 29.45,44.82 30.15,45.52 34.62,45.52 35.46,44.68 A10:U2.8 38.79,44.68 v38.97,44.5
  Top 0.61: v14.37,46.37 14.37,47.01 14.92,47.56 A5:R5.2
  Bottom 0.305: 15.72,46.72 A5:R3.1 | A5:R4.2 14.37,45.01 | v20.24,44.18 v20.24,43.23 20.76,42.71 A5:U1.20 | A10:U1.7 38.62,44.22 v38.97,44.5
  Bottom 0.406: 15.5,46.78 A5:R3.1 15.03,47.04 v14.37,46.37 A5:R4.2 | 42.31,45.96 ☈2.1
  Bottom 0.61: ☈2.1 42.15,45.48 42.15,44.5 | 42.15,44.5 42.15,39.9 42.34,39.7 A7:⌁3.P$1 | v38.97,44.5 42.15,44.5
  other vias: 19.13,21.45 19.21,19.86 11.51,39.7 12.62,39.39 13.41,46.37
  pour Top (isolate 0.152, no thermals): 23.42,19.07 20.24,19.07 19.61,19.7 19.61,21.77 19.37,22 18.97,22 18.73,21.77 18.73,16.21 19.53,15.41 23.42,15.41 23.73,15.73 23.73,18.75
  pour Top (isolate 0.152, no thermals): 11.19,42.56 11.03,42.4 11.03,39.31 11.35,38.99 12.94,38.99 13.26,39.31 13.26,42.4 13.1,42.56
  pour Route15 (isolate 0.152): 11.03,39.39 11.67,38.75 12.78,38.75 13.26,39.23 13.26,43.83 15,45.58 15,46.53 14.68,46.85 13.1,46.85 12.78,46.53 12.78,45.42 11.03,43.67
  pour Top (isolate 0.152, no thermals): 12.78,47.8 12.78,46.37 13.26,45.89 14.68,45.89 15.32,46.53 17.07,46.56 19.61,44.02 19.61,43.23 20.24,42.59 21.19,42.59 21.51,42.91 22.75,42.91 22.78,42.88 22.94,43.04 22.94,45.1 19.13,48.75 13.73,48.75
  pour Route15 (isolate 0.152): 19.61,20.21 19.92,20.53 20.56,20.53 21.19,19.89 24.84,20.05 29.13,24.02 29.13,27.99 30.72,29.74 30.72,31.32 29.29,32.59 29.29,35.29 21.51,43.07 21.51,44.18 21.04,44.66 19.92,44.66 19.61,44.34 19.61,41.48 21.51,39.58 21.51,35.45 22.62,34.34 27.7,34.34 27.7,31.64 28.97,30.37 28.97,29.9 28.5,29.42 27.38,29.42 26.59,28.62 26.59,26.4 22.62,22.12 18.97,22.12 18.5,21.64 18.5,19.73 18.81,19.42 19.29,19.42 19.61,19.73
VF+OUT/IPC  (via drill 0.3)
  other vias: 8.34,48.59 9.61,48.59 7.06,48.59 41.2,43.23 41.2,42.12 40.09,43.23 40.09,42.12
  pour Route15 (isolate 0.152, no thermals): 6.43,48.31 6.75,47.99 19.29,47.99 20.24,47.04 33.73,47.04 35.01,45.77 35.01,45.14 38.97,41.01 41.35,41.01 41.99,41.64 41.99,43.23 41.35,43.87 40.4,43.87 35.01,49.26 6.75,49.26 6.43,48.94
  pour Top (isolate 0.152, no thermals): 8.02,45.1 8.02,47.64 7.54,48.12 6.75,48.12 6.59,48.28 6.59,48.91 6.75,49.07 10.4,49.07 11.19,48.28 11.19,47.8 10.88,47.48 9.92,47.48 9.29,46.85 9.29,45.1 9.21,45.02 8.1,45.02
  pour Top (isolate 0.152, no thermals): 39.45,41.93 39.93,41.45 41.35,41.48 41.83,41.96 41.83,46.56 41.51,46.88 39.77,46.88 39.45,46.53
VF+OUT/SWITCH
  pour Top (isolate 0.152, no thermals): 7.22,47.64 4.37,47.64 4.21,47.48 4.21,45.42 4.34,45.29 5.87,45.29 8.1,42.91 9.53,42.91 9.53,44.66 7.78,44.66 7.22,45.26
✳TOP.MOT+
  pour Top (no thermals): 9.13,21.96 9.29,22.12 9.29,22.59 9.13,22.75 6.91,22.75 6.11,23.55 5.16,23.55 4.68,24.02 4.68,24.66 3.89,25.45 1.03,25.45 0.71,25.13 0.71,23.55 1.03,23.23 3.73,23.23 5,21.96 5,21.16 5.16,21.01 6.11,21.01 7.06,21.96

## Text on the board
tNames: GND | SHT | SHT | GND | +3V3
bNames: P#:KITT-C100'R1 | OSHW / SPFMDBC | UNIVERSITY OF / APPLIED SCIENCE / UPPER AUSTRIA | HSD'16 CarrerAI
Document: Custom Layer Legend | ACTIVE | LAY# | Description | 117 | Simulation Notes | 115 | Mechanical Planning | 114 | NO POPULATE | 46 | Real Estate Planning
Name: ???? / WHAT TO DO WITH PATCHING / ???? | trace as shunt ? | reset/ ADC ref selector for arduino etc? | shield the gates | when ground pour | shield the gates | AREA 6: / MOTOR DRIVER
ThePlan: TODO: / Find +18V route when space is left after airwiring is done | TODO: Add proper jumper bridge | [eq1] | VIN | ERROR | ERROR | ERROR | ERROR | ERROR | TODO: / add an axis guide / on silkscreen layer for gyro | AREA 4: / LOGIC | conf | TODO / ADD OPT. FB NETWORK / BECAUSE LAYOUT | VDD | 10mm